# Altium project PC110.PrjPcb (part 3 of 5)

## Sheet ASIC.SchDoc
size 594 x 420 mm
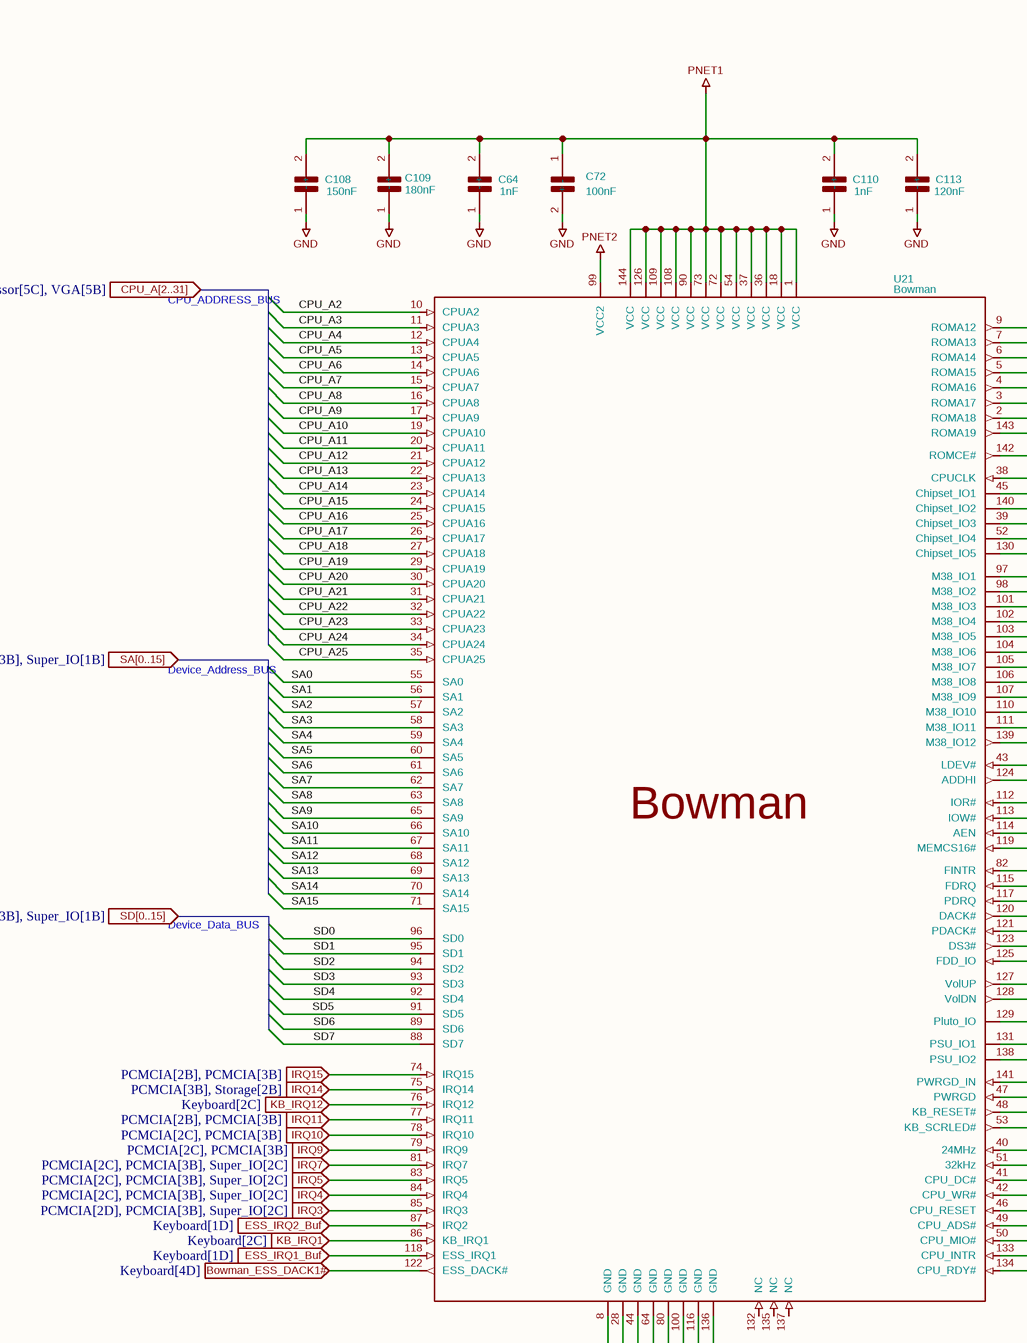
[diagram p20: ASIC.SchDoc, top left]
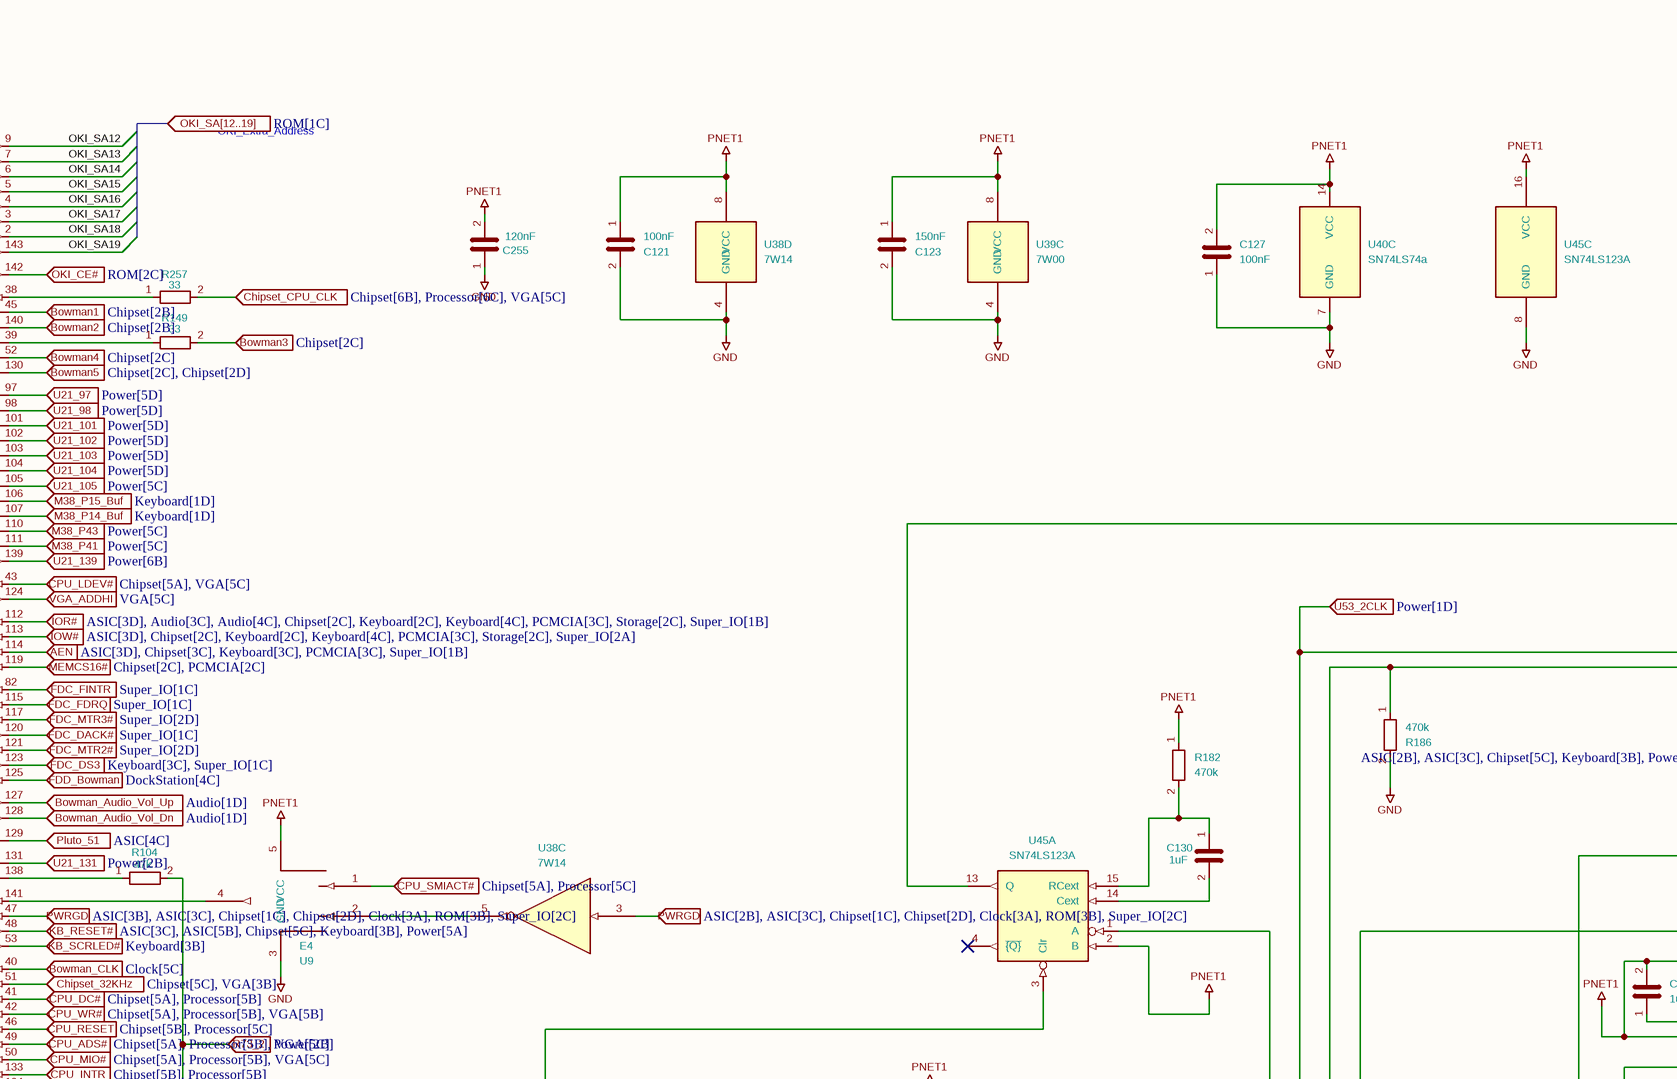
[diagram p21: ASIC.SchDoc, top middle]
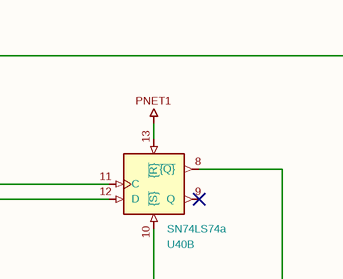
[diagram p22: ASIC.SchDoc, top right]
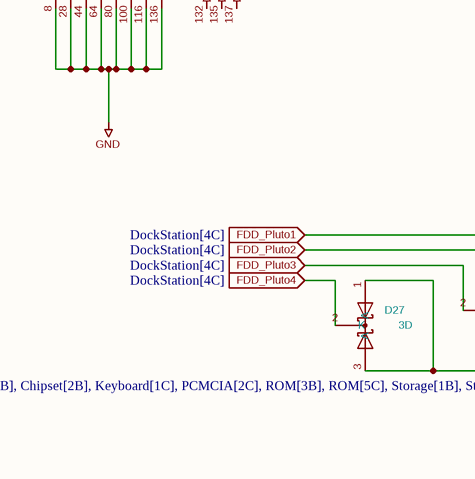
[diagram p23: ASIC.SchDoc, bottom left]
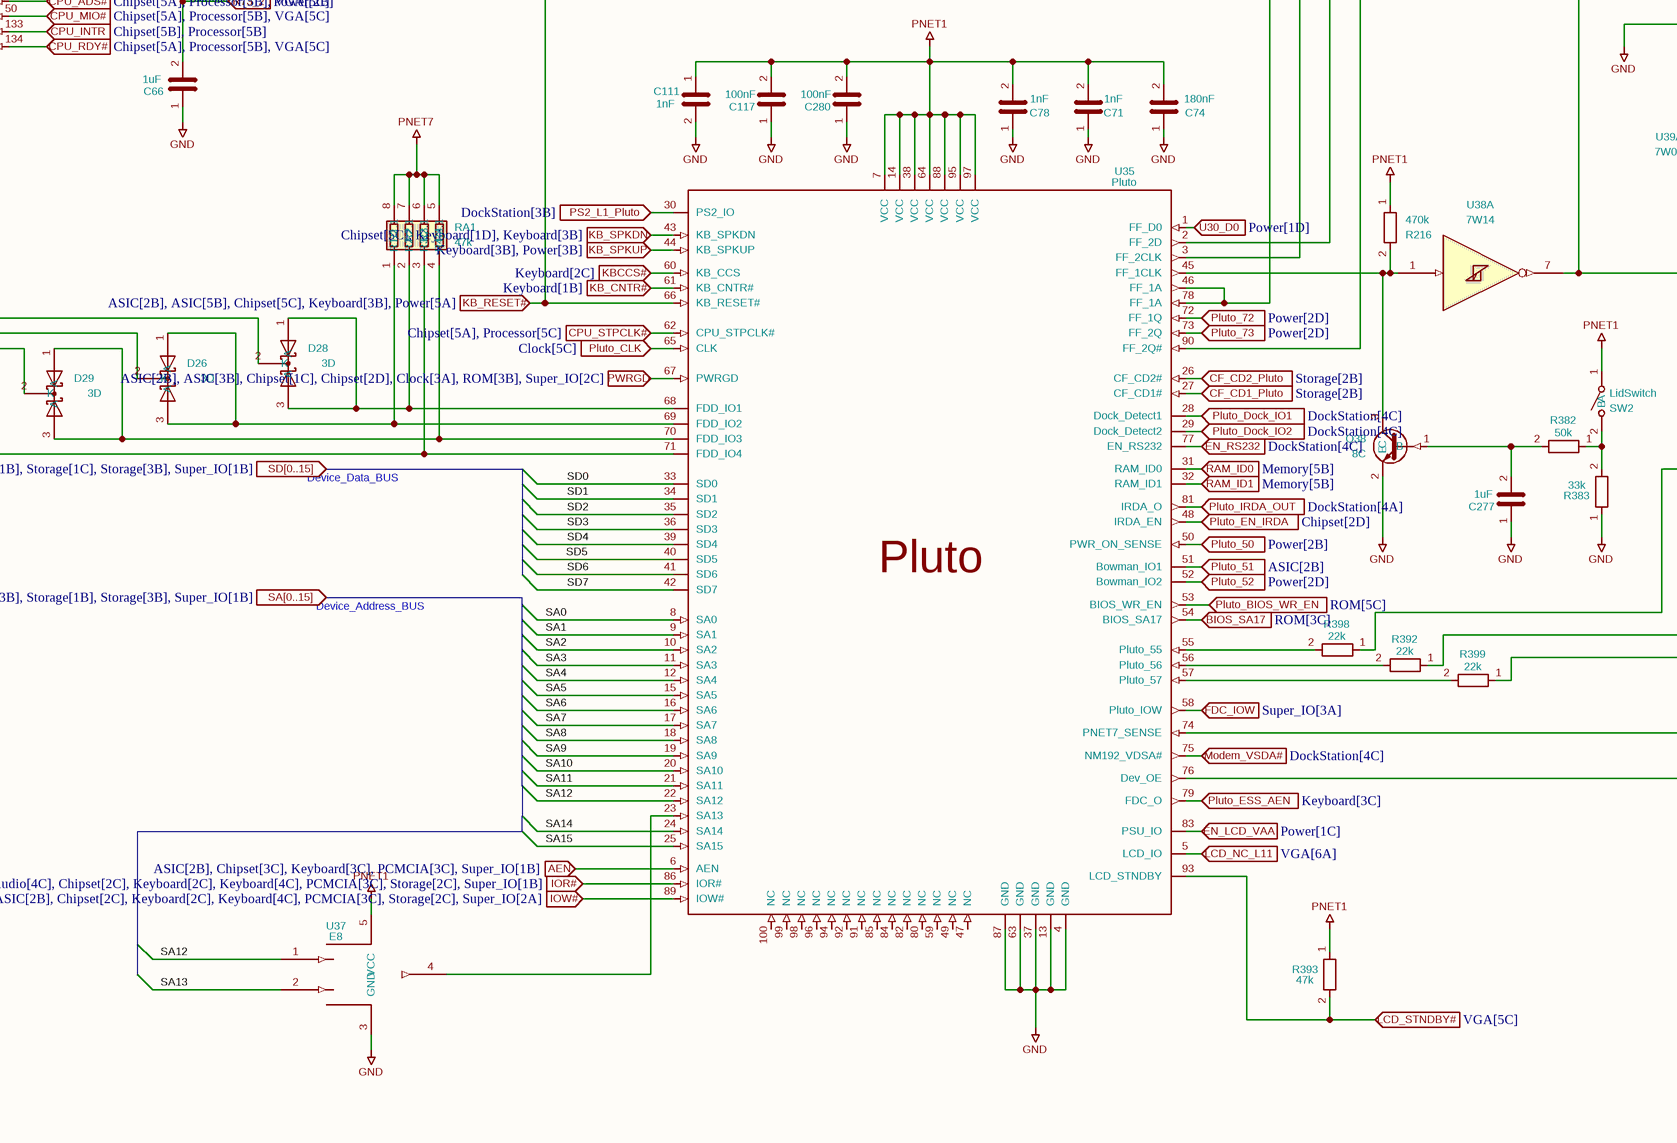
[diagram p24: ASIC.SchDoc, bottom middle]
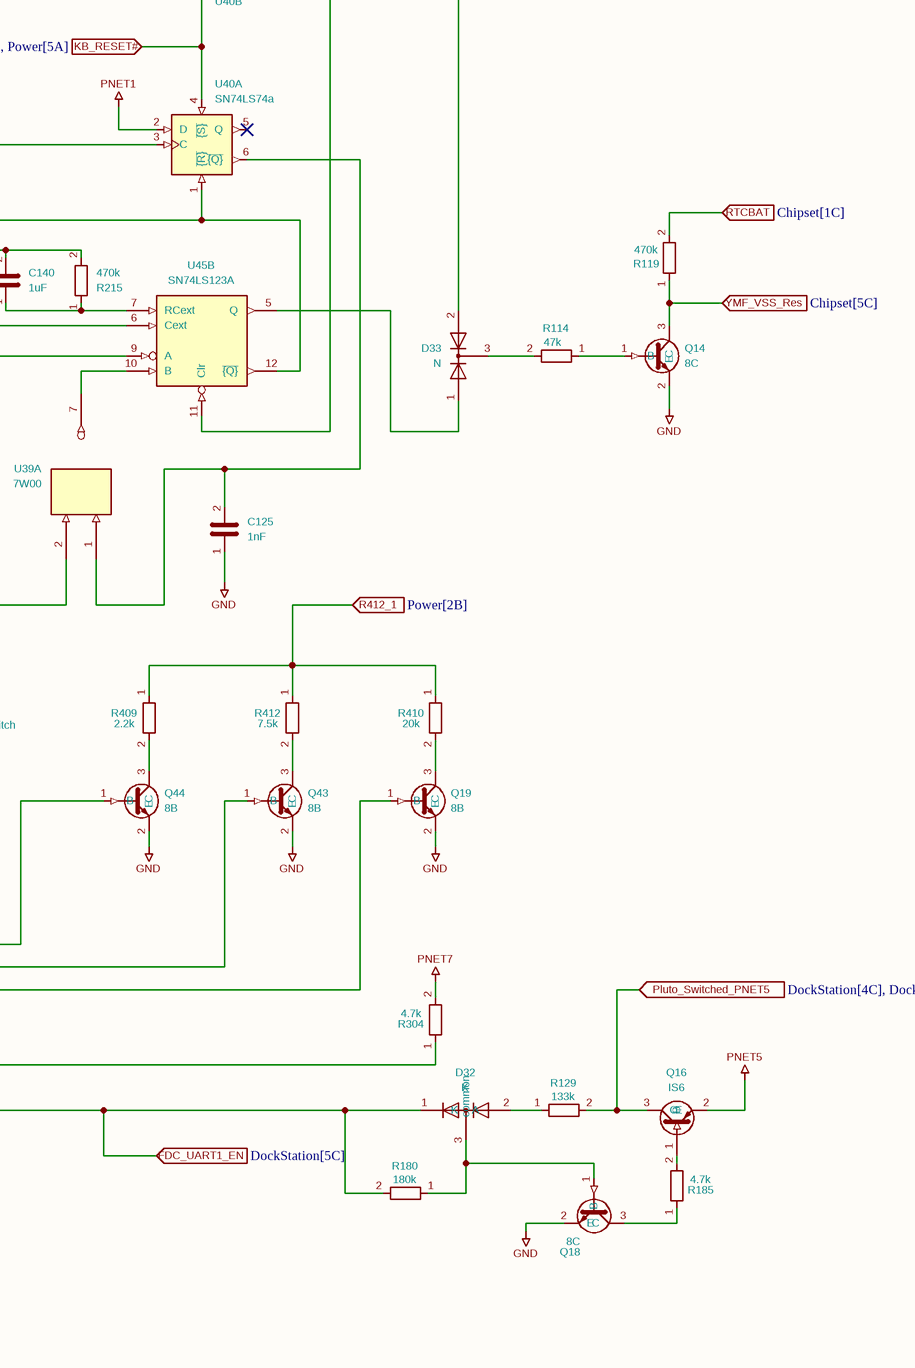
[diagram p25: ASIC.SchDoc, bottom right]

### Parts
C64  1nF  [C_0402_1005Metric]
C66  1uF  [C_0603_1608Metric]
C71  1nF  [C_0402_1005Metric]
C72  100nF  [C_0402_1005Metric]
C74  180nF  [C_0402_1005Metric]
C78  1nF  [C_0402_1005Metric]
C108  150nF  [C_0402_1005Metric]
C109  180nF  [C_0402_1005Metric]
C110  1nF  [C_0402_1005Metric]
C111  1nF  [C_0402_1005Metric]
C113  120nF  [C_0402_1005Metric]
C117  100nF  [C_0402_1005Metric]
C121  100nF  [C_0402_1005Metric]
C123  150nF  [C_0402_1005Metric]
C125  1nF  [C_0402_1005Metric]
C127  100nF  [C_0402_1005Metric]
C130  1uF  [C_0603_1608Metric]
C140  1uF  [C_0603_1608Metric]
C255  120nF  [C_0402_1005Metric]
C277  1uF  [C_0603_1608Metric]
C280  100nF  [C_0402_1005Metric]
D26  3D  [3D]
D27  3D  [3D]
D28  3D  [3D]
D29  3D  [3D]
D32  K  [SOT-416L]
D33  N  [SOT-416]
Q14  8C  [SOT-416]
Q16  IS6  [TSOT-23]
Q18  8C  [SOT-416]
Q19  8B  [SOT-416]
Q38  8C  [SOT-416]
Q43  8B  [SOT-523]
Q44  8B  [SOT-523]
R104  47k  [R_0402_1005Metric]
R114  47k  [R_0402_1005Metric]
R119  470k  [R_0402_1005Metric]
R129  133k  [R_0402_1005Metric]
R149  33  [R_0402_1005Metric]
R180  180k  [R_0402_1005Metric]
R182  470k  [R_0402_1005Metric]
R185  4.7k  [R_0402_1005Metric]
R186  470k  [R_0402_1005Metric]
R215  470k  [R_0402_1005Metric]
R216  470k  [R_0402_1005Metric]
R257  33  [R_0402_1005Metric]
R304  4.7k  [R_0402_1005Metric]
R382  50k  [R_0402_1005Metric]
R383  33k  [R_0402_1005Metric]
R392  22k  [R_0402_1005Metric]
R393  47k  [R_0402_1005Metric]
R398  22k  [R_0402_1005Metric]
R399  22k  [R_0402_1005Metric]
R409  2.2k  [R_0402_1005Metric]
R410  20k  [R_0402_1005Metric]
R412  7.5k  [R_0402_1005Metric]
RA1  47k  [R-array]
SW2  LidSwitch  [LidSwitch]
U9  E4  [SOT-353]
U21  Bowman  [Bowman]
U35  Pluto  [Pluto]
U37  E8  [SOT-353]
U38  7W14  [sso-8]  (parts A,C,D of 4)
U39  7W00  [sso-8]  (parts A,C of 3)
U40  SN74LS74a  [TSSOP-14_4.4x5mm_P0.65mm]  (parts A,B,C of 3)
U45  SN74LS123A  [TSSOP-16_4.4x5mm_P0.65mm]  (parts A,B,C of 3)

### Ports
AEN (in, see ASIC[2B], Chipset[3C], Keyboard[3C], PCMCIA[3C], Super_IO[1B]), AEN (in, see ASIC[3D], Chipset[3C], Keyboard[3C], PCMCIA[3C], Super_IO[1B]), BIOS_SA17 (in, see ROM[3C]), Bowman1 (in, see Chipset[2B]), Bowman2 (in, see Chipset[2B]), Bowman3 (in, see Chipset[2C]), Bowman4 (in, see Chipset[2C]), Bowman5 (in, see Chipset[2C], Chipset[2D]), Bowman_Audio_Vol_Dn (in, see Audio[1D]), Bowman_Audio_Vol_Up (in, see Audio[1D]), Bowman_CLK (in, see Clock[5C]), Bowman_ESS_DACK1# (in, see Keyboard[4D]), CF_CD1_Pluto (in, see Storage[2B]), CF_CD2_Pluto (in, see Storage[2B]), Chipset_32KHz (in, see Chipset[5C], VGA[3B]), Chipset_CPU_CLK (in, see Chipset[6B], Processor[6C], VGA[5C]), CPU_A[2..31] (in, see Chipset[6B], Processor[1B], Processor[5C], VGA[5B]), CPU_ADS# (in, see Chipset[5A], Processor[5B], VGA[5C]), CPU_DC# (in, see Chipset[5A], Processor[5B]), CPU_INTR (in, see Chipset[5B], Processor[5B]), CPU_LDEV# (in, see Chipset[5A], VGA[5C]), CPU_MIO# (in, see Chipset[5A], Processor[5B], VGA[5C]), CPU_RDY# (in, see Chipset[5A], Processor[5B], VGA[5C]), CPU_RESET (in, see Chipset[5B], Processor[5C]), CPU_SMIACT# (in, see Chipset[5A], Processor[5C]), CPU_STPCLK# (in, see Chipset[5A], Processor[5C]), CPU_WR# (in, see Chipset[5A], Processor[5B], VGA[5B]), EN_LCD_VAA (in, see Power[1C]), EN_RS232 (in, see DockStation[4C]), ESS_IRQ1_Buf (in, see Keyboard[1D]), ESS_IRQ2_Buf (in, see Keyboard[1D]), FDC_DACK# (in, see Super_IO[1C]), FDC_DS3 (in, see Keyboard[3C], Super_IO[1C]), FDC_FDRQ (in, see Super_IO[1C]), FDC_FINTR (in, see Super_IO[1C]), FDC_IOW (in, see Super_IO[3A]), FDC_MTR2# (in, see Super_IO[2D]), FDC_MTR3# (in, see Super_IO[2D]), FDC_UART1_EN (in, see DockStation[5C]), FDD_Bowman (in, see DockStation[4C]), FDD_Pluto1 (in, see DockStation[4C]), FDD_Pluto2 (in, see DockStation[4C]), FDD_Pluto3 (in, see DockStation[4C]), FDD_Pluto4 (in, see DockStation[4C]), IOR# (in, see ASIC[2B], Audio[3C], Audio[4C], Chipset[2C], Keyboard[2C], Keyboard[4C], PCMCIA[3C], Storage[2C], Super_IO[1B]), IOR# (in, see ASIC[3D], Audio[3C], Audio[4C], Chipset[2C], Keyboard[2C], Keyboard[4C], PCMCIA[3C], Storage[2C], Super_IO[1B]), IOW# (in, see ASIC[2B], Chipset[2C], Keyboard[2C], Keyboard[4C], PCMCIA[3C], Storage[2C], Super_IO[2A]), IOW# (in, see ASIC[3D], Chipset[2C], Keyboard[2C], Keyboard[4C], PCMCIA[3C], Storage[2C], Super_IO[2A]), IRQ3 (in, see PCMCIA[2D], PCMCIA[3B], Super_IO[2C]), IRQ4 (in, see PCMCIA[2C], PCMCIA[3B], Super_IO[2C]), IRQ5 (in, see PCMCIA[2C], PCMCIA[3B], Super_IO[2C]), IRQ7 (in, see PCMCIA[2C], PCMCIA[3B], Super_IO[2C]), IRQ9 (in, see PCMCIA[2C], PCMCIA[3B]), IRQ10 (in, see PCMCIA[2C], PCMCIA[3B]), IRQ11 (in, see PCMCIA[2B], PCMCIA[3B]), IRQ14 (in, see PCMCIA[3B], Storage[2B]), IRQ15 (in, see PCMCIA[2B], PCMCIA[3B]), KB_CNTR# (in, see Keyboard[1B]), KB_IRQ1 (in, see Keyboard[2C]), KB_IRQ12 (in, see Keyboard[2C]), KB_RESET# (in, see ASIC[2B], ASIC[3C], Chipset[5C], Keyboard[3B], Power[5A]), KB_RESET# (in, see ASIC[2B], ASIC[5B], Chipset[5C], Keyboard[3B], Power[5A]), KB_RESET# (in, see ASIC[3C], ASIC[5B], Chipset[5C], Keyboard[3B], Power[5A]), KB_SCRLED# (in, see Keyboard[3B]), KB_SPKDN (in, see Chipset[5C], Keyboard[1D], Keyboard[3B]), KB_SPKUP (in, see Keyboard[3B], Power[3B]), KBCCS# (in, see Keyboard[2C]), LCD_NC_L11 (in, see VGA[6A]), LCD_STNDBY# (in, see VGA[5C]), M38_P14_Buf (in, see Keyboard[1D]), M38_P15_Buf (in, see Keyboard[1D]), M38_P41 (in, see Power[5C]), M38_P43 (in, see Power[5C]), MEMCS16# (in, see Chipset[2C], PCMCIA[2C]), Modem_VSDA# (in, see DockStation[4C]), OKI_CE# (in, see ROM[2C]), OKI_SA[12..19] (in, see ROM[1C]), Pluto_50 (in, see Power[2B]), Pluto_51 (in, see ASIC[2B]), Pluto_51 (in, see ASIC[4C]), Pluto_52 (in, see Power[2D]), Pluto_72 (in, see Power[2D]), Pluto_73 (in, see Power[2D]), Pluto_BIOS_WR_EN (in, see ROM[5C]), Pluto_CLK (in, see Clock[5C]), Pluto_Dock_IO1 (in, see DockStation[4C]), Pluto_Dock_IO2 (in, see DockStation[4C]), Pluto_EN_IRDA (in, see Chipset[2D]), Pluto_ESS_AEN (in, see Keyboard[3C]), Pluto_IRDA_OUT (in, see DockStation[4A]), Pluto_Switched_PNET5 (in, see DockStation[4C], DockStation[5C]), PS2_L1_Pluto (in, see DockStation[3B]), PWRGD (in, see ASIC[2B], ASIC[3B], Chipset[1C], Chipset[2D], Clock[3A], ROM[3B], Super_IO[2C]), PWRGD (in, see ASIC[2B], ASIC[3C], Chipset[1C], Chipset[2D], Clock[3A], ROM[3B], Super_IO[2C]), PWRGD (in, see ASIC[3B], ASIC[3C], Chipset[1C], Chipset[2D], Clock[3A], ROM[3B], Super_IO[2C]), R73_2 (in, see Power[2B]), R412_1 (in, see Power[2B]), RAM_ID0 (in, see Memory[5B]), RAM_ID1 (in, see Memory[5B]), RTCBAT (in, see Chipset[1C]), SA[0..15] (in, see ASIC[1B], Audio[4B], Chipset[2D], Chipset[6B], Keyboard[1C], PCMCIA[2B], ROM[1B], ROM[3B], Storage[1B], Storage[3B], Super_IO[1B]), SA[0..15] (in, see ASIC[3D], Audio[4B], Chipset[2D], Chipset[6B], Keyboard[1C], PCMCIA[2B], ROM[1B], ROM[3B], Storage[1B], Storage[3B], Super_IO[1B]), SD[0..15] (in, see ASIC[1B], Audio[3B], Chipset[2B], Keyboard[1C], PCMCIA[2C], ROM[3B], ROM[5C], Storage[1B], Storage[1C], Storage[3B], Super_IO[1B]), SD[0..15] (in, see ASIC[3C], Audio[3B], Chipset[2B], Keyboard[1C], PCMCIA[2C], ROM[3B], ROM[5C], Storage[1B], Storage[1C], Storage[3B], Super_IO[1B]), U21_97 (in, see Power[5D]), U21_98 (in, see Power[5D]), U21_101 (in, see Power[5D]), U21_102 (in, see Power[5D]), U21_103 (in, see Power[5D]), U21_104 (in, see Power[5D]), U21_105 (in, see Power[5C]), U21_131 (in, see Power[2B]), U21_139 (in, see Power[6B]), U30_D0 (in, see Power[1D]), U53_2CLK (in, see Power[1D]), VGA_ADDHI (in, see VGA[5C]), YMF_VSS_Res (in, see Chipset[5C])

### Nets
GND: C64.1(+) C66.1 C71.1 C72.2(-) C74.1 C78.1 C108.1(+) C109.1(+) C110.1(+) C111.2 C113.1(+) C117.1 C121.2 C123.2 C125.1 C127.1 C255.1 C277.1 C280.1 Q14.2(E) Q18.2(E) Q19.2(E) Q38.2(E) Q43.2(E) Q44.2(E) R186.2 R383.1 U9.3(GND) U21.8(GND) U21.28(GND) U21.44(GND) U21.64(GND) U21.80(GND) U21.100(GND) U21.116(GND) U21.136(GND) U35.4(GND) U35.13(GND) U35.37(GND) U35.63(GND) U35.87(GND) U37.3(GND) U38.4(GND) U39.4(GND) U40.7(GND) U45.8(GND) U45.9(A)
PNET1: C64.2(-) C71.2 C72.1(+) C74.2 C78.2 C108.2(-) C109.2(-) C110.2(-) C111.1 C113.2(-) C117.2 C121.1 C123.1 C127.2 C140.2 C255.2 C280.2 R182.1 R215.2 R216.1 R393.1 SW2.1(A) U9.5(VCC) U21.1(VCC) U21.18(VCC) U21.36(VCC) U21.37(VCC) U21.54(VCC) U21.72(VCC) U21.73(VCC) U21.90(VCC) U21.108(VCC) U21.109(VCC) U21.126(VCC) U21.144(VCC) U35.7(VCC) U35.14(VCC) U35.38(VCC) U35.64(VCC) U35.88(VCC) U35.95(VCC) U35.97(VCC) U37.5(VCC) U38.8(VCC) U39.8(VCC) U40.2(D) U40.13(~{{R}}) U40.14(VCC) U45.2(B) U45.6(Cext) U45.16(VCC)
PNET2: U21.99(VCC2)
PNET5: Q16.2(E)
PNET7: R304.2 RA1.5(R4.2) RA1.6(R3.2) RA1.7(R2.2) RA1.8(R1.2)
AEN: U21.114(AEN) U35.6(AEN) ; port AEN
BIOS_SA17: U35.54(BIOS_SA17) ; port BIOS_SA17
Bowman1: U21.45(Chipset_IO1) ; port Bowman1
Bowman2: U21.140(Chipset_IO2) ; port Bowman2
Bowman3: R149.2 ; port Bowman3
Bowman4: U21.52(Chipset_IO4) ; port Bowman4
Bowman5: U21.130(Chipset_IO5) ; port Bowman5
Bowman_Audio_Vol_Dn: U21.128(VolDN) ; port Bowman_Audio_Vol_Dn
Bowman_Audio_Vol_Up: U21.127(VolUP) ; port Bowman_Audio_Vol_Up
Bowman_CLK: U21.40(24MHz) ; port Bowman_CLK
Bowman_ESS_DACK1#: U21.122(ESS_DACK#) ; port Bowman_ESS_DACK1#
CF_CD1_Pluto: U35.27(CF_CD1#) ; port CF_CD1_Pluto
CF_CD2_Pluto: U35.26(CF_CD2#) ; port CF_CD2_Pluto
Chipset_32KHz: U21.51(32kHz) ; port Chipset_32KHz
Chipset_CPU_CLK: R257.2 ; port Chipset_CPU_CLK
CPU_A2: U21.10(CPUA2)
CPU_A3: U21.11(CPUA3)
CPU_A4: U21.12(CPUA4)
CPU_A5: U21.13(CPUA5)
CPU_A6: U21.14(CPUA6)
CPU_A7: U21.15(CPUA7)
CPU_A8: U21.16(CPUA8)
CPU_A9: U21.17(CPUA9)
CPU_A10: U21.19(CPUA10)
CPU_A11: U21.20(CPUA11)
CPU_A12: U21.21(CPUA12)
CPU_A13: U21.22(CPUA13)
CPU_A14: U21.23(CPUA14)
CPU_A15: U21.24(CPUA15)
CPU_A16: U21.25(CPUA16)
CPU_A17: U21.26(CPUA17)
CPU_A18: U21.27(CPUA18)
CPU_A19: U21.29(CPUA19)
CPU_A20: U21.30(CPUA20)
CPU_A21: U21.31(CPUA21)
CPU_A22: U21.32(CPUA22)
CPU_A23: U21.33(CPUA23)
CPU_A24: U21.34(CPUA24)
CPU_A25: U21.35(CPUA25)
CPU_ADS#: U21.49(CPU_ADS#) ; port CPU_ADS#
CPU_DC#: U21.41(CPU_DC#) ; port CPU_DC#
CPU_INTR: U21.133(CPU_INTR) ; port CPU_INTR
CPU_LDEV#: U21.43(LDEV#) ; port CPU_LDEV#
CPU_MIO#: U21.50(CPU_MIO#) ; port CPU_MIO#
CPU_RDY#: U21.134(CPU_RDY#) ; port CPU_RDY#
CPU_RESET: U21.46(CPU_RESET) ; port CPU_RESET
CPU_SMIACT#: U9.1 ; port CPU_SMIACT#
CPU_STPCLK#: U35.62(CPU_STPCLK#) ; port CPU_STPCLK#
CPU_WR#: U21.42(CPU_WR#) ; port CPU_WR#
EN_LCD_VAA: U35.83(PSU_IO) ; port EN_LCD_VAA
EN_RS232: U35.77(EN_RS232) ; port EN_RS232
ESS_IRQ1_Buf: U21.118(ESS_IRQ1) ; port ESS_IRQ1_Buf
ESS_IRQ2_Buf: U21.87(IRQ2) ; port ESS_IRQ2_Buf
FDC_DACK#: U21.120(DACK#) ; port FDC_DACK#
FDC_DS3: U21.123(DS3#) ; port FDC_DS3
FDC_FDRQ: U21.115(FDRQ) ; port FDC_FDRQ
FDC_FINTR: U21.82(FINTR) ; port FDC_FINTR
FDC_IOW: U35.58(Pluto_IOW) ; port FDC_IOW
FDC_MTR2#: U21.121(PDACK#) ; port FDC_MTR2#
FDC_MTR3#: U21.117(PDRQ) ; port FDC_MTR3#
FDC_UART1_EN: D32.1(K) R180.2 U35.76(Dev_OE) ; port FDC_UART1_EN
FDD_Bowman: U21.125(FDD_IO) ; port FDD_Bowman
FDD_Pluto1: D28.2(K) ; port FDD_Pluto1
FDD_Pluto2: D26.2(K) ; port FDD_Pluto2
FDD_Pluto3: D29.2(K) ; port FDD_Pluto3
FDD_Pluto4: D27.2(K) ; port FDD_Pluto4
IOR#: U21.112(IOR#) U35.86(IOR#) ; port IOR#
IOW#: U21.113(IOW#) U35.89(IOW#) ; port IOW#
IRQ3: U21.85(IRQ3) ; port IRQ3
IRQ4: U21.84(IRQ4) ; port IRQ4
IRQ5: U21.83(IRQ5) ; port IRQ5
IRQ7: U21.81(IRQ7) ; port IRQ7
IRQ9: U21.79(IRQ9) ; port IRQ9
IRQ10: U21.78(IRQ10) ; port IRQ10
IRQ11: U21.77(IRQ11) ; port IRQ11
IRQ14: U21.75(IRQ14) ; port IRQ14
IRQ15: U21.74(IRQ15) ; port IRQ15
KB_CNTR#: U35.61(KB_CNTR#) ; port KB_CNTR#
KB_IRQ1: U21.86(KB_IRQ1) ; port KB_IRQ1
KB_IRQ12: U21.76(IRQ12) ; port KB_IRQ12
KB_RESET#: U21.48(KB_RESET#) U35.66(KB_RESET#) U40.4(~{{S}}) U40.10(~{{S}}) U45.3(Clr) ; port KB_RESET#
KB_SCRLED#: U21.53(KB_SCRLED#) ; port KB_SCRLED#
KB_SPKDN: U35.43(KB_SPKDN) ; port KB_SPKDN
KB_SPKUP: U35.44(KB_SPKUP) ; port KB_SPKUP
KBCCS#: U35.60(KB_CCS) ; port KBCCS#
LCD_NC_L11: U35.5(LCD_IO) ; port LCD_NC_L11
LCD_STNDBY#: R393.2 U35.93(LCD_STNDBY) ; port LCD_STNDBY#
M38_P14_Buf: U21.107(M38_IO9) ; port M38_P14_Buf
M38_P15_Buf: U21.106(M38_IO8) ; port M38_P15_Buf
M38_P41: U21.111(M38_IO11) ; port M38_P41
M38_P43: U21.110(M38_IO10) ; port M38_P43
MEMCS16#: U21.119(MEMCS16#) ; port MEMCS16#
Modem_VSDA#: U35.75(NM192_VDSA#) ; port Modem_VSDA#
OKI_CE#: U21.142(ROMCE#) ; port OKI_CE#
OKI_SA12: U21.9(ROMA12)
OKI_SA13: U21.7(ROMA13)
OKI_SA14: U21.6(ROMA14)
OKI_SA15: U21.5(ROMA15)
OKI_SA16: U21.4(ROMA16)
OKI_SA17: U21.3(ROMA17)
OKI_SA18: U21.2(ROMA18)
OKI_SA19: U21.143(ROMA19)
Pluto_50: U35.50(PWR_ON_SENSE) ; port Pluto_50
Pluto_51: U21.129(Pluto_IO) U35.51(Bowman_IO1) ; port Pluto_51
Pluto_52: U35.52(Bowman_IO2) ; port Pluto_52
Pluto_72: U35.72(FF_1Q) ; port Pluto_72
Pluto_73: U35.73(FF_2Q) ; port Pluto_73
Pluto_BIOS_WR_EN: U35.53(BIOS_WR_EN) ; port Pluto_BIOS_WR_EN
Pluto_CLK: U35.65(CLK) ; port Pluto_CLK
Pluto_Dock_IO1: U35.28(Dock_Detect1) ; port Pluto_Dock_IO1
Pluto_Dock_IO2: U35.29(Dock_Detect2) ; port Pluto_Dock_IO2
Pluto_EN_IRDA: U35.48(IRDA_EN) ; port Pluto_EN_IRDA
Pluto_ESS_AEN: U35.79(FDC_O) ; port Pluto_ESS_AEN
Pluto_IRDA_OUT: U35.81(IRDA_O) ; port Pluto_IRDA_OUT
Pluto_Switched_PNET5: Q16.3(C) R129.2 ; port Pluto_Switched_PNET5
PS2_L1_Pluto: U35.30(PS2_IO) ; port PS2_L1_Pluto
PWRGD: U21.47(PWRGD) U35.67(PWRGD) U38.3 ; port PWRGD
R73_2: C66.2 R104.2 ; port R73_2
R412_1: R409.1 R410.1 R412.1 ; port R412_1
RAM_ID0: U35.31(RAM_ID0) ; port RAM_ID0
RAM_ID1: U35.32(RAM_ID1) ; port RAM_ID1
RTCBAT: R119.2 ; port RTCBAT
SA0: U21.55(SA0) U35.8(SA0)
SA1: U21.56(SA1) U35.9(SA1)
SA2: U21.57(SA2) U35.10(SA2)
SA3: U21.58(SA3) U35.11(SA3)
SA4: U21.59(SA4) U35.12(SA4)
SA5: U21.60(SA5) U35.15(SA5)
SA6: U21.61(SA6) U35.16(SA6)
SA7: U21.62(SA7) U35.17(SA7)
SA8: U21.63(SA8) U35.18(SA8)
SA9: U21.65(SA9) U35.19(SA9)
SA10: U21.66(SA10) U35.20(SA10)
SA11: U21.67(SA11) U35.21(SA11)
SA12: U21.68(SA12) U35.22(SA12) U37.1
SA13: U21.69(SA13) U37.2
SA14: U21.70(SA14) U35.24(SA14)
SA15: U21.71(SA15) U35.25(SA15)
SD0: U21.96(SD0) U35.33(SD0)
SD1: U21.95(SD1) U35.34(SD1)
SD2: U21.94(SD2) U35.35(SD2)
SD3: U21.93(SD3) U35.36(SD3)
SD4: U21.92(SD4) U35.39(SD4)
SD5: U21.91(SD5) U35.40(SD5)
SD6: U21.89(SD6) U35.41(SD6)
SD7: U21.88(SD7) U35.42(SD7)
U21_97: U21.97(M38_IO1) ; port U21_97
U21_98: U21.98(M38_IO2) ; port U21_98
U21_101: U21.101(M38_IO3) ; port U21_101
U21_102: U21.102(M38_IO4) ; port U21_102
U21_103: U21.103(M38_IO5) ; port U21_103
U21_104: U21.104(M38_IO6) ; port U21_104
U21_105: U21.105(M38_IO7) ; port U21_105
U21_131: U21.131(PSU_IO1) ; port U21_131
U21_139: U21.139(M38_IO12) ; port U21_139
U30_D0: U35.1(FF_D0) ; port U30_D0
U53_2CLK: U35.3(FF_2CLK) U40.11(C) ; port U53_2CLK
VGA_ADDHI: U21.124(ADDHI) ; port VGA_ADDHI
YMF_VSS_Res: Q14.3(C) R119.1 ; port YMF_VSS_Res
NetC125_2: C125.2 U39.1 U40.6(~{{Q}})
NetC130_1: C130.1 R182.2 U45.15(RCext)
NetC130_2: C130.2 U45.14(Cext)
NetC140_1: C140.1 R215.1 U45.7(RCext)
NetC277_2: C277.2 Q38.1(B) R382.2
NetD26_1: D26.1(A) D26.3(A) RA1.1(R1.1) U35.69(FDD_IO2)
NetD27_1: D27.1(A) D27.3(A) RA1.3(R3.1) U35.71(FDD_IO4)
NetD28_1: D28.1(A) D28.3(A) RA1.2(R2.1) U35.68(FDD_IO1)
NetD29_1: D29.1(A) D29.3(A) RA1.4(R4.1) U35.70(FDD_IO3)
NetD32_2: D32.2(A) R129.1
NetD32_3: D32.3(common) Q18.1(B) R180.1
NetD33_1: D33.1 U45.5(Q)
NetD33_2: D33.2 U45.13(Q)
NetD33_3: D33.3 R114.2
NetQ14_1: Q14.1(B) R114.1
NetQ16_1: Q16.1(B) R185.2
NetQ18_3: Q18.3(C) R185.1
NetQ19_1: Q19.1(B) R399.1
NetQ19_3: Q19.3(C) R410.2
NetQ38_3: Q38.3(C) R216.2 U35.45(FF_1CLK) U38.1
NetQ43_1: Q43.1(B) R392.1
NetQ43_3: Q43.3(C) R412.2
NetQ44_1: Q44.1(B) R398.1
NetQ44_3: Q44.3(C) R409.2
NetR104_1: R104.1 U21.138(PSU_IO2)
NetR149_1: R149.1 U21.39(Chipset_IO3)
NetR186_1: R186.1 U35.2(FF_2D) U40.12(D)
NetR257_1: R257.1 U21.38(CPUCLK)
NetR304_1: R304.1 U35.74(PNET7_SENSE)
NetR382_1: R382.1 R383.2 SW2.2(B)
NetR392_2: R392.2 U35.56(Pluto_56)
NetR398_2: R398.2 U35.55(Pluto_55)
NetR399_2: R399.2 U35.57(Pluto_57)
NetU9_2: U9.2 U38.5
NetU9_4: U9.4 U21.141(PWRGD_IN)
NetU35_23: U35.23(SA13) U37.4
NetU35_46: U35.46(FF_1A) U35.78(FF_1A) U45.1(A)
NetU35_90: U35.90(FF_2Q#) U40.1(~{{R}}) U45.12(~{{Q}})
NetU38_7: U38.7 U39.2 U40.3(C)
NetU39_7: U39.7 U45.10(B)
NetU40_8: U40.8(~{{Q}}) U45.11(Clr)

Not connected (* = marked no-connect by the designer): U21 132(NC) 135(NC) 137(NC); U35 47(NC) 49(NC) 59(NC) 80(NC) 82(NC) 84(NC) 85(NC) 91(NC) 92(NC) 94(NC) 96(NC) 98(NC) 99(NC) 100(NC); U40 5(Q)* 9(Q)*; U45 4(~{{Q}})*

### Notes on the sheet
- CPU_ADDRESS_BUS
- OKI_Extra_Address
- Device_Address_BUS
- Device_Data_BUS
- 1
- 2
- 3
- 4
- 5
- 6
- 7
- 8
- 9
- 10
- 11
- A
- B
- C
- D
- E
- F
- G
- H
- Title: PC110
- File: ASIC.kicad_sch
- Sheet: /
- Recreated by: Ahmad Byagowi
- KiCad E.D.A.  kicad (5.1.4)-1
- Size: A2
- Date:
- Rev:
- Id: 1/1

### Library data of the parts
C64 C66 C71 C72 C74 C78 C108-C111 C113 C117 C121 C123 C125 C127 C130 C140 C255 C277 C280 = C
  C64 C71 C78 C110 C111 C125: Value: 1nF; Footprint: Capacitor_SMD:C_0402_1005Metric
  C66 C130 C140 C277: Value: 1uF; Footprint: Capacitor_SMD:C_0603_1608Metric
  C72 C117 C121 C127 C280: Value: 100nF; Footprint: Capacitor_SMD:C_0402_1005Metric
  C74 C109: Value: 180nF; Footprint: Capacitor_SMD:C_0402_1005Metric
  C108 C123: Value: 150nF; Footprint: Capacitor_SMD:C_0402_1005Metric
  C113 C255: Value: 120nF; Footprint: Capacitor_SMD:C_0402_1005Metric
D26-D29 = D_Schottky_Dual_CommonCathode_AKA: Value: 3D; Footprint: PC110:3D
D32 = D_Dual_Series_KAC: Value: K; Footprint: PC110:SOT-416L
D33 = 3D_Diode: Value: N; Footprint: Package_TO_SOT_SMD:SOT-416
Q14 Q18 Q19 Q38 Q43 Q44 = MMBTA44
  Q14 Q18 Q38: Value: 8C; Footprint: Package_TO_SOT_SMD:SOT-416
  Q19: Value: 8B; Footprint: Package_TO_SOT_SMD:SOT-416
  Q43 Q44: Value: 8B; Footprint: Package_TO_SOT_SMD:SOT-523
Q16 = Q_PNP_Generic_BEC: Value: IS6; Footprint: PCM_Package_TO_SOT_SMD_AKL:TSOT-23
R104 R114 R119 R129 R149 R180 R182 R185 R186 R215 R216 R257 R304 R382 R383 R392 R393 R398 R399 R409 R410 R412 = R
  R104 R114: Value: 47k; Footprint: PCM_Resistor_SMD_AKL:R_0402_1005Metric
  R119 R182 R186 R215 R216: Value: 470k; Footprint: PCM_Resistor_SMD_AKL:R_0402_1005Metric
  R129: Value: 133k; Footprint: PCM_Resistor_SMD_AKL:R_0402_1005Metric
  R149: Value: 33; Footprint: PCM_Resistor_SMD_AKL:R_0402_1005Metric
  R180: Value: 180k; Footprint: PCM_Resistor_SMD_AKL:R_0402_1005Metric
  R185: Value: 4.7k; Footprint: PCM_Resistor_SMD_AKL:R_0402_1005Metric
  R257: Value: 33; Footprint: Resistor_SMD:R_0402_1005Metric
  R304: Value: 4.7k; Footprint: Resistor_SMD:R_0402_1005Metric
  R382: Value: 50k; Footprint: Resistor_SMD:R_0402_1005Metric
  R383: Value: 33k; Footprint: Resistor_SMD:R_0402_1005Metric
  R392 R398 R399: Value: 22k; Footprint: Resistor_SMD:R_0402_1005Metric
  R393: Value: 47k; Footprint: Resistor_SMD:R_0402_1005Metric
  R409: Value: 2.2k; Footprint: Resistor_SMD:R_0402_1005Metric
  R410: Value: 20k; Footprint: Resistor_SMD:R_0402_1005Metric
  R412: Value: 7.5k; Footprint: Resistor_SMD:R_0402_1005Metric
RA1 = R_Pack04: Value: 47k; Footprint: PC110:R-array
SW2 = SW_SPST: Value: LidSwitch; Footprint: PC110:LidSwitch
U9 = 74AHC1G32: Value: E4; Footprint: PC110:SOT-353
U37 = 74AHC1G86: Value: E8; Footprint: PC110:SOT-353
U38 = 74LVC3G14: Value: 7W14; Footprint: PC110:sso-8
U39 = 74AHC2G00: Value: 7W00; Footprint: PC110:sso-8
U40 = 74HC74: Value: SN74LS74a; Footprint: Package_SO:TSSOP-14_4.4x5mm_P0.65mm
U45 = 74HC123: Value: SN74LS123A; Footprint: Package_SO:TSSOP-16_4.4x5mm_P0.65mm
U21 = Bowman: Value: Bowman; Footprint: PC110:Bowman
U35 = Pluto: Value: Pluto; Footprint: PC110:Pluto

## Sheet Keyboard.SchDoc
size 420 x 297 mm
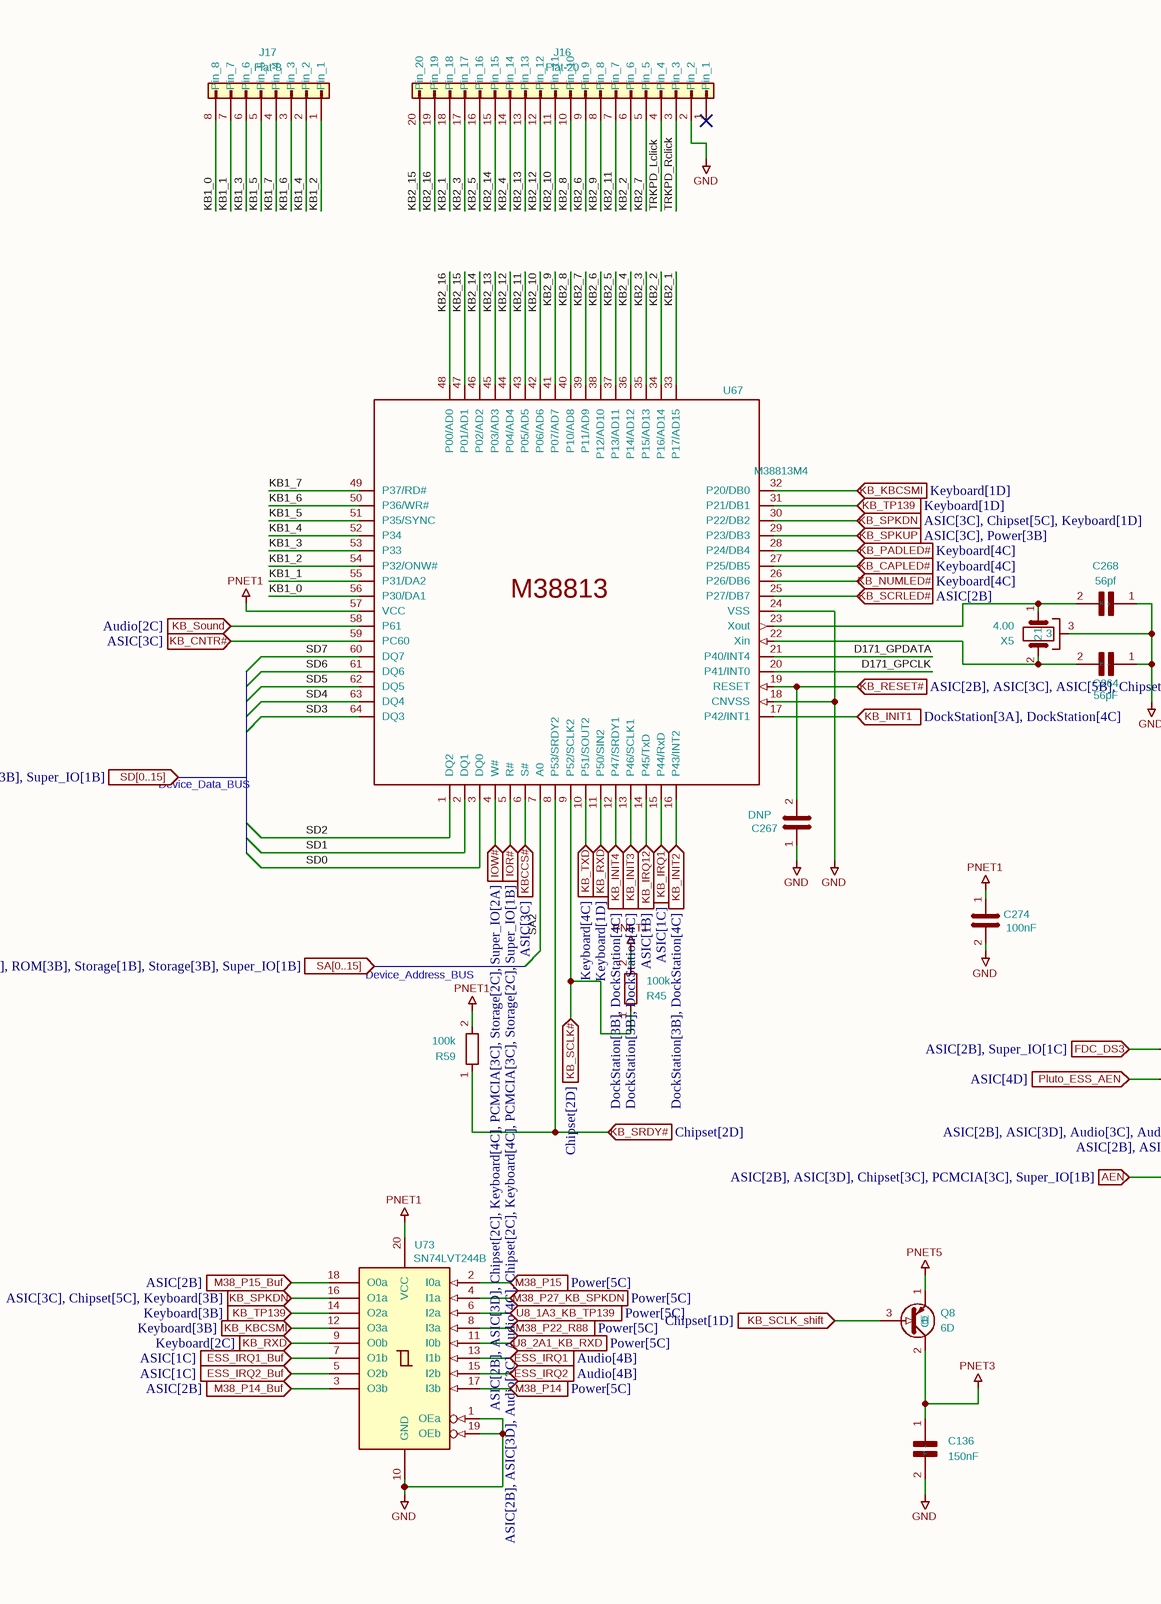
[diagram p26: Keyboard.SchDoc, left]
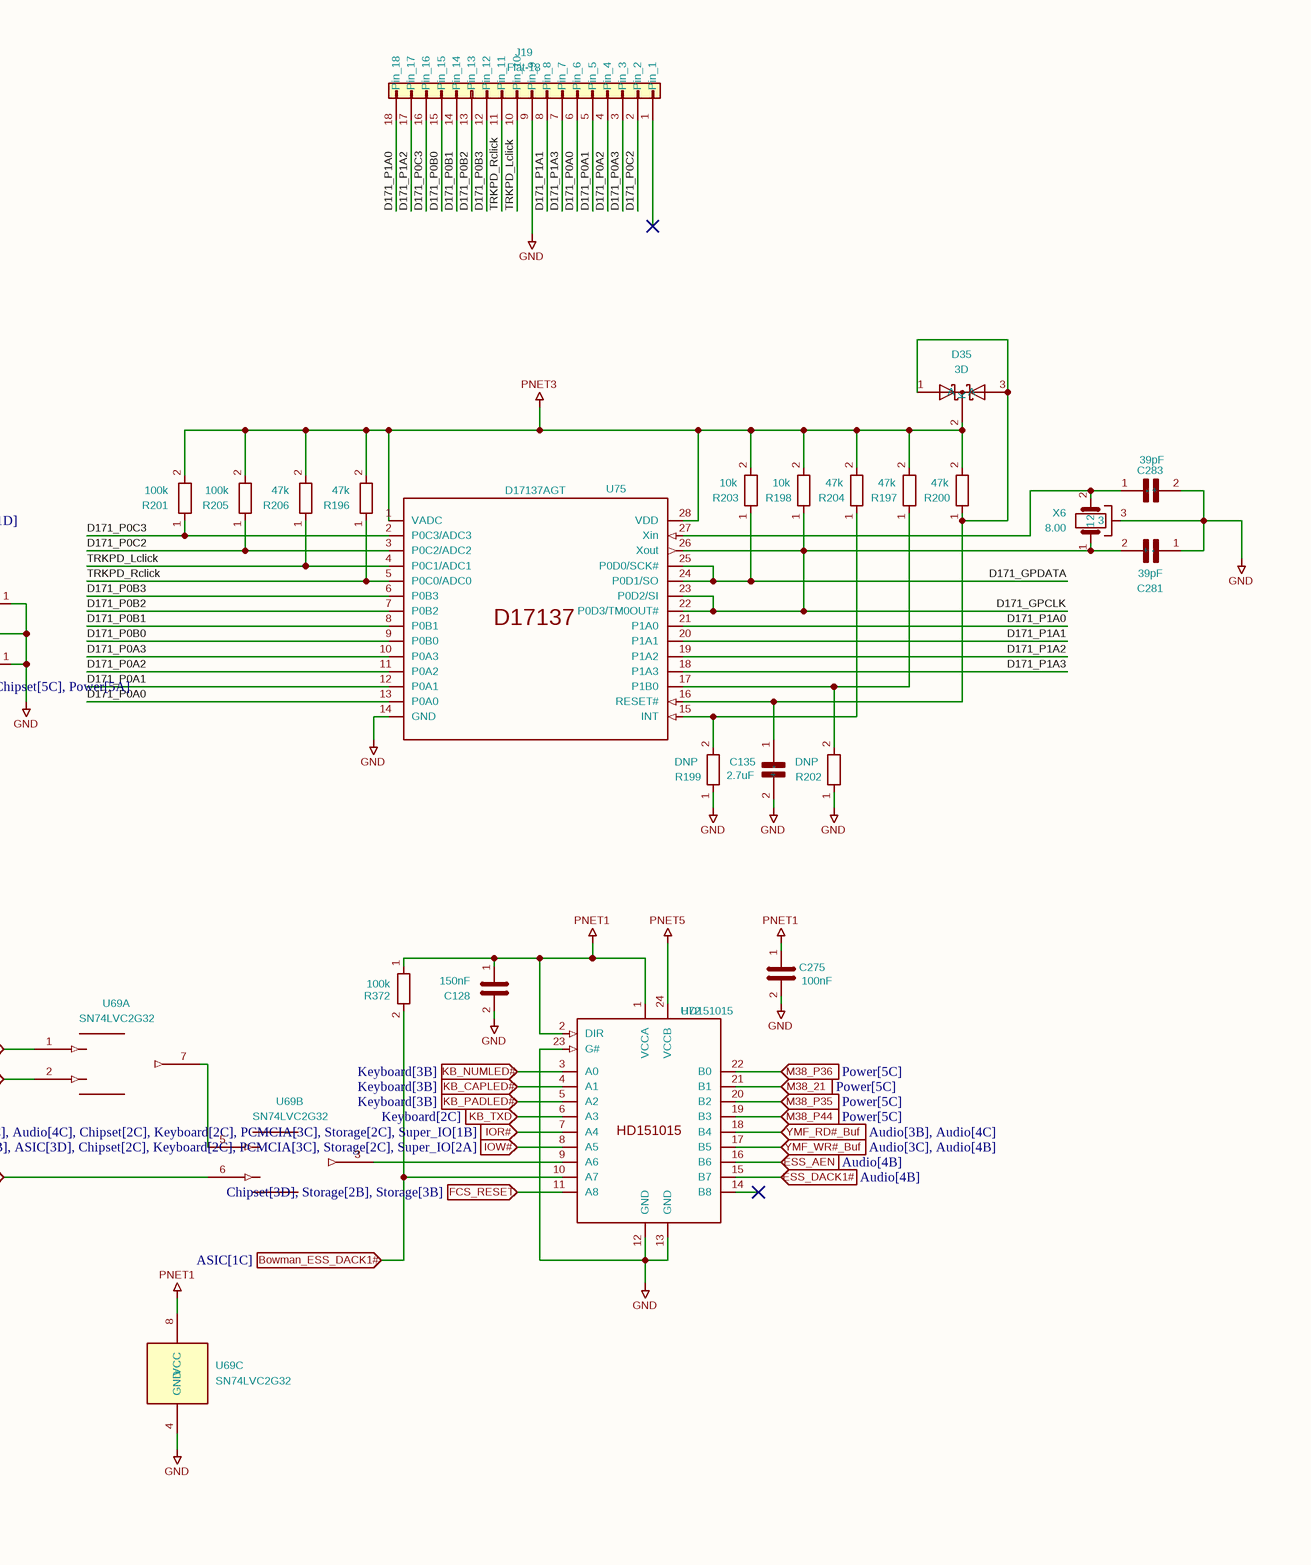
[diagram p27: Keyboard.SchDoc, right]

### Parts
C128  150nF  [C_0402_1005Metric]
C135  2.7uF  [C_0805_2012Metric]
C136  150nF  [C_0402_1005Metric]
C264  56pF  [C_0402_1005Metric]
C267  DNP  [C_0402_1005Metric]
C268  56pf  [C_0402_1005Metric]
C274  100nF  [C_0402_1005Metric]
C275  100nF  [C_0402_1005Metric]
C281  39pF  [C_0402_1005Metric]
C283  39pF  [C_0402_1005Metric]
D35  3D  [3D]
J16  Flat-20  [Flat-20]
J17  Flat-8  [Flat-8]
J19  Flat-18  [Flat-18]
Q8  6D  [3D]
R45  100k  [R_0402_1005Metric]
R59  100k  [R_0402_1005Metric]
R196  47k  [R_0402_1005Metric]
R197  47k  [R_0402_1005Metric]
R198  10k  [R_0402_1005Metric]
R199  DNP  [R_0402_1005Metric]
R200  47k  [R_0402_1005Metric]
R201  100k  [R_0402_1005Metric]
R202  DNP  [R_0402_1005Metric]
R203  10k  [R_0402_1005Metric]
R204  47k  [R_0402_1005Metric]
R205  100k  [R_0402_1005Metric]
R206  47k  [R_0402_1005Metric]
R372  100k  [R_0402_1005Metric]
U67  M38813M4  [QFN64]
U69  SN74LVC2G32  [SSOP-8_2.95x2.8mm_P0.65mm]  (parts A,B,C of 3)
U72  HD151015  [SSOP-24_5.3x8.2mm_P0.65mm]
U73  SN74LVT244B  [TSSOP-20_4.4x6.5mm_P0.65mm]
U75  D17137AGT  [SSOP-28]
X5  4.00  [XTAL-5]
X6  8.00  [XTAL-4]

### Ports
AEN (in, see ASIC[2B], ASIC[3D], Chipset[3C], PCMCIA[3C], Super_IO[1B]), Bowman_ESS_DACK1# (in, see ASIC[1C]), ESS_AEN (in, see Audio[4B]), ESS_DACK1# (in, see Audio[4B]), ESS_IRQ1 (in, see Audio[4B]), ESS_IRQ1_Buf (in, see ASIC[1C]), ESS_IRQ2 (in, see Audio[4B]), ESS_IRQ2_Buf (in, see ASIC[1C]), FCS_RESET (in, see Chipset[3D], Storage[2B], Storage[3B]), FDC_DS3 (in, see ASIC[2B], Super_IO[1C]), IOR# (in, see ASIC[2B], ASIC[3D], Audio[3C], Audio[4C], Chipset[2C], Keyboard[2C], PCMCIA[3C], Storage[2C], Super_IO[1B]), IOR# (in, see ASIC[2B], ASIC[3D], Audio[3C], Audio[4C], Chipset[2C], Keyboard[4C], PCMCIA[3C], Storage[2C], Super_IO[1B]), IOW# (in, see ASIC[2B], ASIC[3D], Chipset[2C], Keyboard[2C], PCMCIA[3C], Storage[2C], Super_IO[2A]), IOW# (in, see ASIC[2B], ASIC[3D], Chipset[2C], Keyboard[4C], PCMCIA[3C], Storage[2C], Super_IO[2A]), KB_CAPLED# (in, see Keyboard[3B]), KB_CAPLED# (in, see Keyboard[4C]), KB_CNTR# (in, see ASIC[3C]), KB_INIT1 (in, see DockStation[3A], DockStation[4C]), KB_INIT2 (in, see DockStation[3B], DockStation[4C]), KB_INIT3 (in, see DockStation[3B], DockStation[4C]), KB_INIT4 (in, see DockStation[3B], DockStation[4C]), KB_IRQ1 (in, see ASIC[1C]), KB_IRQ12 (in, see ASIC[1B]), KB_KBCSMI (in, see Keyboard[1D]), KB_KBCSMI (in, see Keyboard[3B]), KB_NUMLED# (in, see Keyboard[3B]), KB_NUMLED# (in, see Keyboard[4C]), KB_PADLED# (in, see Keyboard[3B]), KB_PADLED# (in, see Keyboard[4C]), KB_RESET# (in, see ASIC[2B], ASIC[3C], ASIC[5B], Chipset[5C], Power[5A]), KB_RXD (in, see Keyboard[1D]), KB_RXD (in, see Keyboard[2C]), KB_SCLK# (in, see Chipset[2D]), KB_SCLK_shift (in, see Chipset[1D]), KB_SCRLED# (in, see ASIC[2B]), KB_Sound (in, see Audio[2C]), KB_SPKDN (in, see ASIC[3C], Chipset[5C], Keyboard[1D]), KB_SPKDN (in, see ASIC[3C], Chipset[5C], Keyboard[3B]), KB_SPKUP (in, see ASIC[3C], Power[3B]), KB_SRDY# (in, see Chipset[2D]), KB_TP139 (in, see Keyboard[1D]), KB_TP139 (in, see Keyboard[3B]), KB_TXD (in, see Keyboard[2C]), KB_TXD (in, see Keyboard[4C]), KBCCS# (in, see ASIC[3C]), M38_21 (in, see Power[5C]), M38_P14 (in, see Power[5C]), M38_P14_Buf (in, see ASIC[2B]), M38_P15 (in, see Power[5C]), M38_P15_Buf (in, see ASIC[2B]), M38_P22_R88 (in, see Power[5C]), M38_P27_KB_SPKDN (in, see Power[5C]), M38_P35 (in, see Power[5C]), M38_P36 (in, see Power[5C]), M38_P44 (in, see Power[5C]), Pluto_ESS_AEN (in, see ASIC[4D]), SA[0..15] (in, see ASIC[1B], ASIC[3D], Audio[4B], Chipset[2D], Chipset[6B], PCMCIA[2B], ROM[1B], ROM[3B], Storage[1B], Storage[3B], Super_IO[1B]), SD[0..15] (in, see ASIC[1B], ASIC[3C], Audio[3B], Chipset[2B], PCMCIA[2C], ROM[3B], ROM[5C], Storage[1B], Storage[1C], Storage[3B], Super_IO[1B]), U8_1A3_KB_TP139 (in, see Power[5C]), U8_2A1_KB_RXD (in, see Power[5C]), YMF_RD#_Buf (in, see Audio[3B], Audio[4C]), YMF_WR#_Buf (in, see Audio[3C], Audio[4B])

### Nets
GND: C128.2 C135.2(-) C136.2(-) C264.1(+) C267.1 C268.1(+) C274.2 C275.2 C281.1(+) C283.2(-) J16.2(Pin_2) J19.9(Pin_9) R199.1 R202.1 U67.18(CNVSS) U67.24(VSS) U69.4(GND) U72.12(GND) U72.13(GND) U72.23(G#) U73.1(OEa) U73.10(GND) U73.19(OEb) U75.14(GND) X5.3 X6.3
PNET1: C128.1 C274.1 C275.1 R45.2 R59.2 R372.1 U67.57(VCC) U69.8(VCC) U72.1(VCCA) U72.2(DIR) U73.20(VCC)
PNET3: C136.1(+) D35.2(K) Q8.2(C) R196.2 R197.2 R198.2 R200.2 R201.2 R203.2 R204.2 R205.2 R206.2 U75.1(VADC) U75.28(VDD)
PNET5: Q8.1(E) U72.24(VCCB)
AEN: U69.6 ; port AEN
Bowman_ESS_DACK1#: R372.2 U72.10(A7) ; port Bowman_ESS_DACK1#
D171_GPCLK: C281.2(-) R198.1 U67.20(P41/INT0) U75.22(P0D3/TM0OUT#) U75.23(P0D2/SI) U75.26(Xout) X6.1
D171_GPDATA: R203.1 U67.21(P40/INT4) U75.24(P0D1/SO) U75.25(P0D0/SCK#)
D171_P0A0: J19.6(Pin_6) U75.13(P0A0)
D171_P0A1: J19.5(Pin_5) U75.12(P0A1)
D171_P0A2: J19.4(Pin_4) U75.11(P0A2)
D171_P0A3: J19.3(Pin_3) U75.10(P0A3)
D171_P0B0: J19.15(Pin_15) U75.9(P0B0)
D171_P0B1: J19.14(Pin_14) U75.8(P0B1)
D171_P0B2: J19.13(Pin_13) U75.7(P0B2)
D171_P0B3: J19.12(Pin_12) U75.6(P0B3)
D171_P0C2: J19.2(Pin_2) R205.1 U75.3(P0C2/ADC2)
D171_P0C3: J19.16(Pin_16) R201.1 U75.2(P0C3/ADC3)
D171_P1A0: J19.18(Pin_18) U75.21(P1A0)
D171_P1A1: J19.8(Pin_8) U75.20(P1A1)
D171_P1A2: J19.17(Pin_17) U75.19(P1A2)
D171_P1A3: J19.7(Pin_7) U75.18(P1A3)
ESS_AEN: U72.16(B6) ; port ESS_AEN
ESS_DACK1#: U72.15(B7) ; port ESS_DACK1#
ESS_IRQ1: U73.13(I1b) ; port ESS_IRQ1
ESS_IRQ1_Buf: U73.7(O1b) ; port ESS_IRQ1_Buf
ESS_IRQ2: U73.15(I2b) ; port ESS_IRQ2
ESS_IRQ2_Buf: U73.5(O2b) ; port ESS_IRQ2_Buf
FCS_RESET: U72.11(A8) ; port FCS_RESET
FDC_DS3: U69.1 ; port FDC_DS3
IOR#: U67.5(R#) U72.7(A4) ; port IOR#
IOW#: U67.4(W#) U72.8(A5) ; port IOW#
KB1_0: J17.8(Pin_8) U67.56(P30/DA1)
KB1_1: J17.7(Pin_7) U67.55(P31/DA2)
KB1_2: J17.1(Pin_1) U67.54(P32/ONW#)
KB1_3: J17.6(Pin_6) U67.53(P33)
KB1_4: J17.2(Pin_2) U67.52(P34)
KB1_5: J17.5(Pin_5) U67.51(P35/SYNC)
KB1_6: J17.3(Pin_3) U67.50(P36/WR#)
KB1_7: J17.4(Pin_4) U67.49(P37/RD#)
KB2_1: J16.18(Pin_18) U67.33(P17/AD15)
KB2_2: J16.6(Pin_6) U67.34(P16/AD14)
KB2_3: J16.17(Pin_17) U67.35(P15/AD13)
KB2_4: J16.14(Pin_14) U67.36(P14/AD12)
KB2_5: J16.16(Pin_16) U67.37(P13/AD11)
KB2_6: J16.9(Pin_9) U67.38(P12/AD10)
KB2_7: J16.5(Pin_5) U67.39(P11/AD9)
KB2_8: J16.10(Pin_10) U67.40(P10/AD8)
KB2_9: J16.8(Pin_8) U67.41(P07/AD7)
KB2_10: J16.11(Pin_11) U67.42(P06/AD6)
KB2_11: J16.7(Pin_7) U67.43(P05/AD5)
KB2_12: J16.12(Pin_12) U67.44(P04/AD4)
KB2_13: J16.13(Pin_13) U67.45(P03/AD3)
KB2_14: J16.15(Pin_15) U67.46(P02/AD2)
KB2_15: J16.20(Pin_20) U67.47(P01/AD1)
KB2_16: J16.19(Pin_19) U67.48(P00/AD0)
KB_CAPLED#: U67.27(P25/DB5) U72.4(A1) ; port KB_CAPLED#
KB_CNTR#: U67.59(PC60) ; port KB_CNTR#
KB_INIT1: U67.17(P42/INT1) ; port KB_INIT1
KB_INIT2: U67.16(P43/INT2) ; port KB_INIT2
KB_INIT3: U67.13(P46/SCLK1) ; port KB_INIT3
KB_INIT4: U67.12(P47/SRDY1) ; port KB_INIT4
KB_IRQ1: U67.15(P44/RxD) ; port KB_IRQ1
KB_IRQ12: U67.14(P45/TxD) ; port KB_IRQ12
KB_KBCSMI: U67.32(P20/DB0) U73.12(O3a) ; port KB_KBCSMI
KB_NUMLED#: U67.26(P26/DB6) U72.3(A0) ; port KB_NUMLED#
KB_PADLED#: U67.28(P24/DB4) U72.5(A2) ; port KB_PADLED#
KB_RESET#: C267.2 U67.19(RESET) ; port KB_RESET#
KB_RXD: U67.11(P50/SIN2) U73.9(O0b) ; port KB_RXD
KB_SCLK#: R45.1 U67.9(P52/SCLK2) ; port KB_SCLK#
KB_SCLK_shift: Q8.3(B) ; port KB_SCLK_shift
KB_SCRLED#: U67.25(P27/DB7) ; port KB_SCRLED#
KB_Sound: U67.58(P61) ; port KB_Sound
KB_SPKDN: U67.30(P22/DB2) U73.16(O1a) ; port KB_SPKDN
KB_SPKUP: U67.29(P23/DB3) ; port KB_SPKUP
KB_SRDY#: R59.1 U67.8(P53/SRDY2) ; port KB_SRDY#
KB_TP139: U67.31(P21/DB1) U73.14(O2a) ; port KB_TP139
KB_TXD: U67.10(P51/SOUT2) U72.6(A3) ; port KB_TXD
KBCCS#: U67.6(S#) ; port KBCCS#
M38_21: U72.21(B1) ; port M38_21
M38_P14: U73.17(I3b) ; port M38_P14
M38_P14_Buf: U73.3(O3b) ; port M38_P14_Buf
M38_P15: U73.2(I0a) ; port M38_P15
M38_P15_Buf: U73.18(O0a) ; port M38_P15_Buf
M38_P22_R88: U73.8(I3a) ; port M38_P22_R88
M38_P27_KB_SPKDN: U73.4(I1a) ; port M38_P27_KB_SPKDN
M38_P35: U72.20(B2) ; port M38_P35
M38_P36: U72.22(B0) ; port M38_P36
M38_P44: U72.19(B3) ; port M38_P44
Pluto_ESS_AEN: U69.2 ; port Pluto_ESS_AEN
SA2: U67.7(A0)
SD0: U67.3(DQ0)
SD1: U67.2(DQ1)
SD2: U67.1(DQ2)
SD3: U67.64(DQ3)
SD4: U67.63(DQ4)
SD5: U67.62(DQ5)
SD6: U67.61(DQ6)
SD7: U67.60(DQ7)
TRKPD_Lclick: J16.4(Pin_4) J19.10(Pin_10) R206.1 U75.4(P0C1/ADC1)
TRKPD_Rclick: J16.3(Pin_3) J19.11(Pin_11) R196.1 U75.5(P0C0/ADC0)
U8_1A3_KB_TP139: U73.6(I2a) ; port U8_1A3_KB_TP139
U8_2A1_KB_RXD: U73.11(I0b) ; port U8_2A1_KB_RXD
YMF_RD#_Buf: U72.18(B4) ; port YMF_RD#_Buf
YMF_WR#_Buf: U72.17(B5) ; port YMF_WR#_Buf
NetC135_1: C135.1(+) D35.1(A) D35.3(A) R200.1 U75.16(RESET#)
NetC264_2: C264.2(-) U67.22(Xin) X5.2
NetC268_2: C268.2(-) U67.23(Xout) X5.1
NetC283_1: C283.1(+) U75.27(Xin) X6.2
NetR197_1: R197.1 R202.2 U75.17(P1B0)
NetR199_2: R199.2 R204.1 U75.15(INT)
NetU69_3: U69.3 U72.9(A6)
NetU69_5: U69.5 U69.7

Not connected (* = marked no-connect by the designer): J16 1(Pin_1)*; J19 1(Pin_1)*; U72 14(B8)*

### Notes on the sheet
- Device_Data_BUS
- (near R59) Device_Address_BUS
- 1
- 2
- 3
- 4
- 5
- 6
- 7
- 8
- A
- B
- C
- D
- E
- Title: PC110
- File: Keyboard.kicad_sch
- Sheet: /
- Recreated by: Ahmad Byagowi
- F
- KiCad E.D.A.  kicad (5.1.4)-1
- Size: A3
- Date:
- Rev:
- Id: 1/1

### Library data of the parts
C128 C135 C136 C264 C267 C268 C274 C275 C281 C283 = C
  C128 C136: Value: 150nF; Footprint: Capacitor_SMD:C_0402_1005Metric
  C135: Value: 2.7uF; Footprint: Capacitor_SMD:C_0805_2012Metric
  C264: Value: 56pF; Footprint: Capacitor_SMD:C_0402_1005Metric
  C267: Value: DNP; Footprint: Capacitor_SMD:C_0402_1005Metric
  C268: Value: 56pf; Footprint: Capacitor_SMD:C_0402_1005Metric
  C274 C275: Value: 100nF; Footprint: Capacitor_SMD:C_0402_1005Metric
  C281 C283: Value: 39pF; Footprint: Capacitor_SMD:C_0402_1005Metric
D35 = D_Schottky_Dual_CommonCathode_AKA: Value: 3D; Footprint: PC110:3D
J16 = Conn_01x20: Value: Flat-20; Footprint: PC110:Flat-20
J17 = Conn_01x08: Value: Flat-8; Footprint: PC110:Flat-8
J19 = Conn_01x18: Value: Flat-18; Footprint: PC110:Flat-18
Q8 = Q_PNP_Generic_ECB: Value: 6D; Footprint: PC110:3D
R45 R59 R196-R206 R372 = R
  R45 R59 R201 R205: Value: 100k; Footprint: PCM_Resistor_SMD_AKL:R_0402_1005Metric
  R196 R197 R200 R204 R206: Value: 47k; Footprint: PCM_Resistor_SMD_AKL:R_0402_1005Metric
  R198 R203: Value: 10k; Footprint: PCM_Resistor_SMD_AKL:R_0402_1005Metric
  R199 R202: Value: DNP; Footprint: PCM_Resistor_SMD_AKL:R_0402_1005Metric
  R372: Value: 100k; Footprint: Resistor_SMD:R_0402_1005Metric
U67 = M38813: Value: M38813M4; Footprint: PC110:QFN64
U69 = 74LVC2G32: Value: SN74LVC2G32; Footprint: Package_SO:SSOP-8_2.95x2.8mm_P0.65mm
U73 = 74LS244: Value: SN74LVT244B; Footprint: Package_SO:TSSOP-20_4.4x6.5mm_P0.65mm
U75 = D17137: Value: D17137AGT; Footprint: PC110:SSOP-28
X5 X6 = Crystal_GND3
  X5: Value: 4.00; Footprint: PC110:XTAL-5
  X6: Value: 8.00; Footprint: PC110:XTAL-4
U72 = HD151015: Value: HD151015; Footprint: Package_SO:SSOP-24_5.3x8.2mm_P0.65mm

## Sheet VGA.SchDoc
size 594 x 420 mm
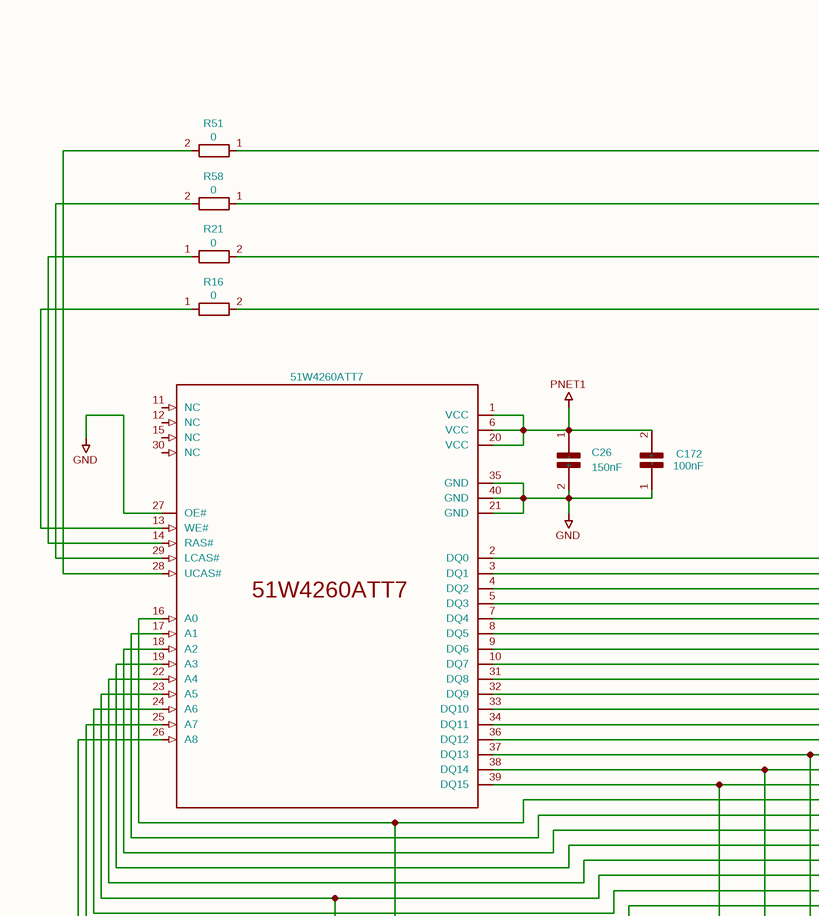
[diagram p28: VGA.SchDoc, top left]
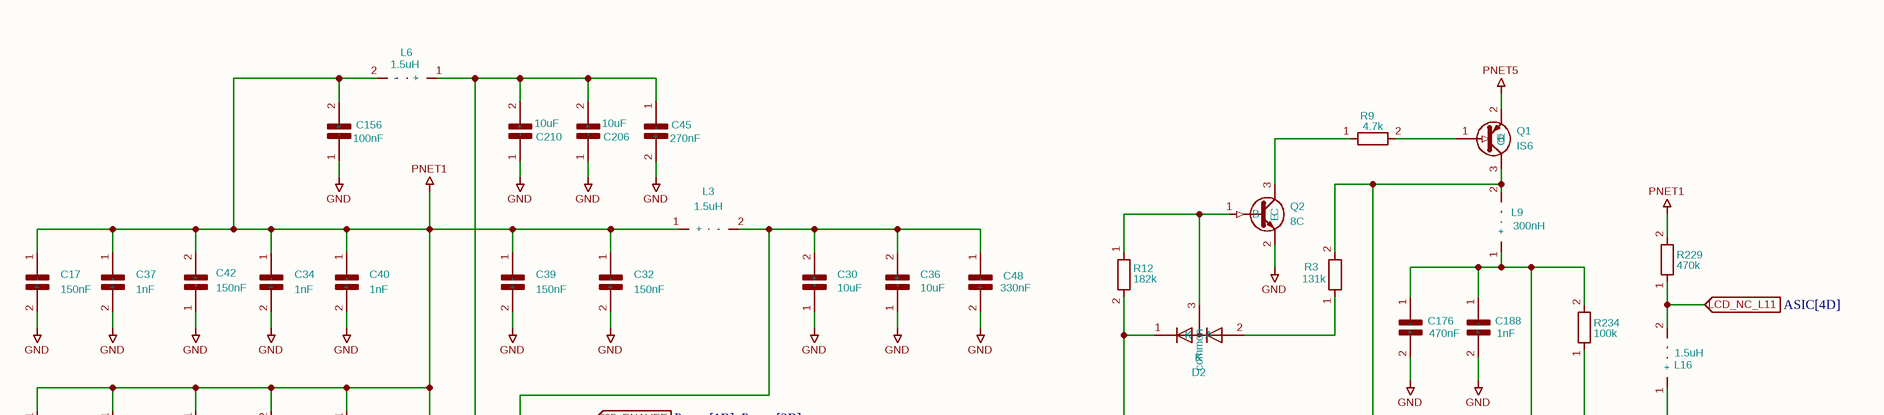
[diagram p29: VGA.SchDoc, top right]
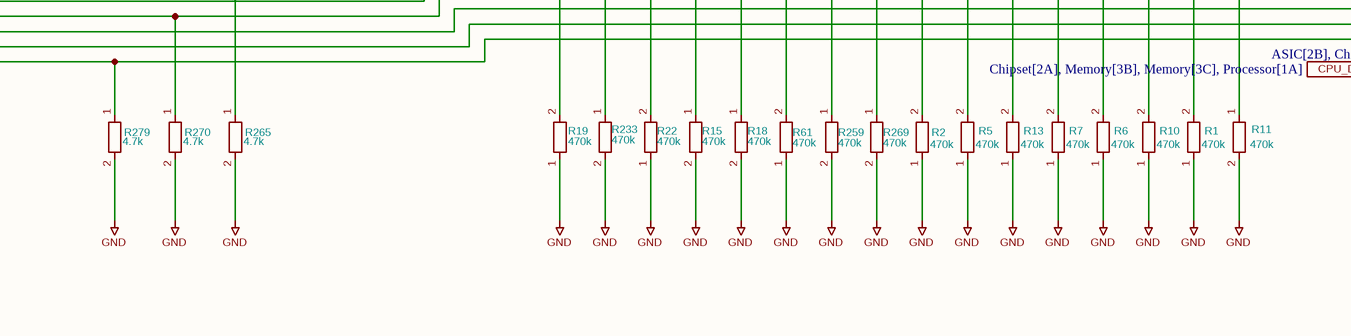
[diagram p30: VGA.SchDoc, bottom left]
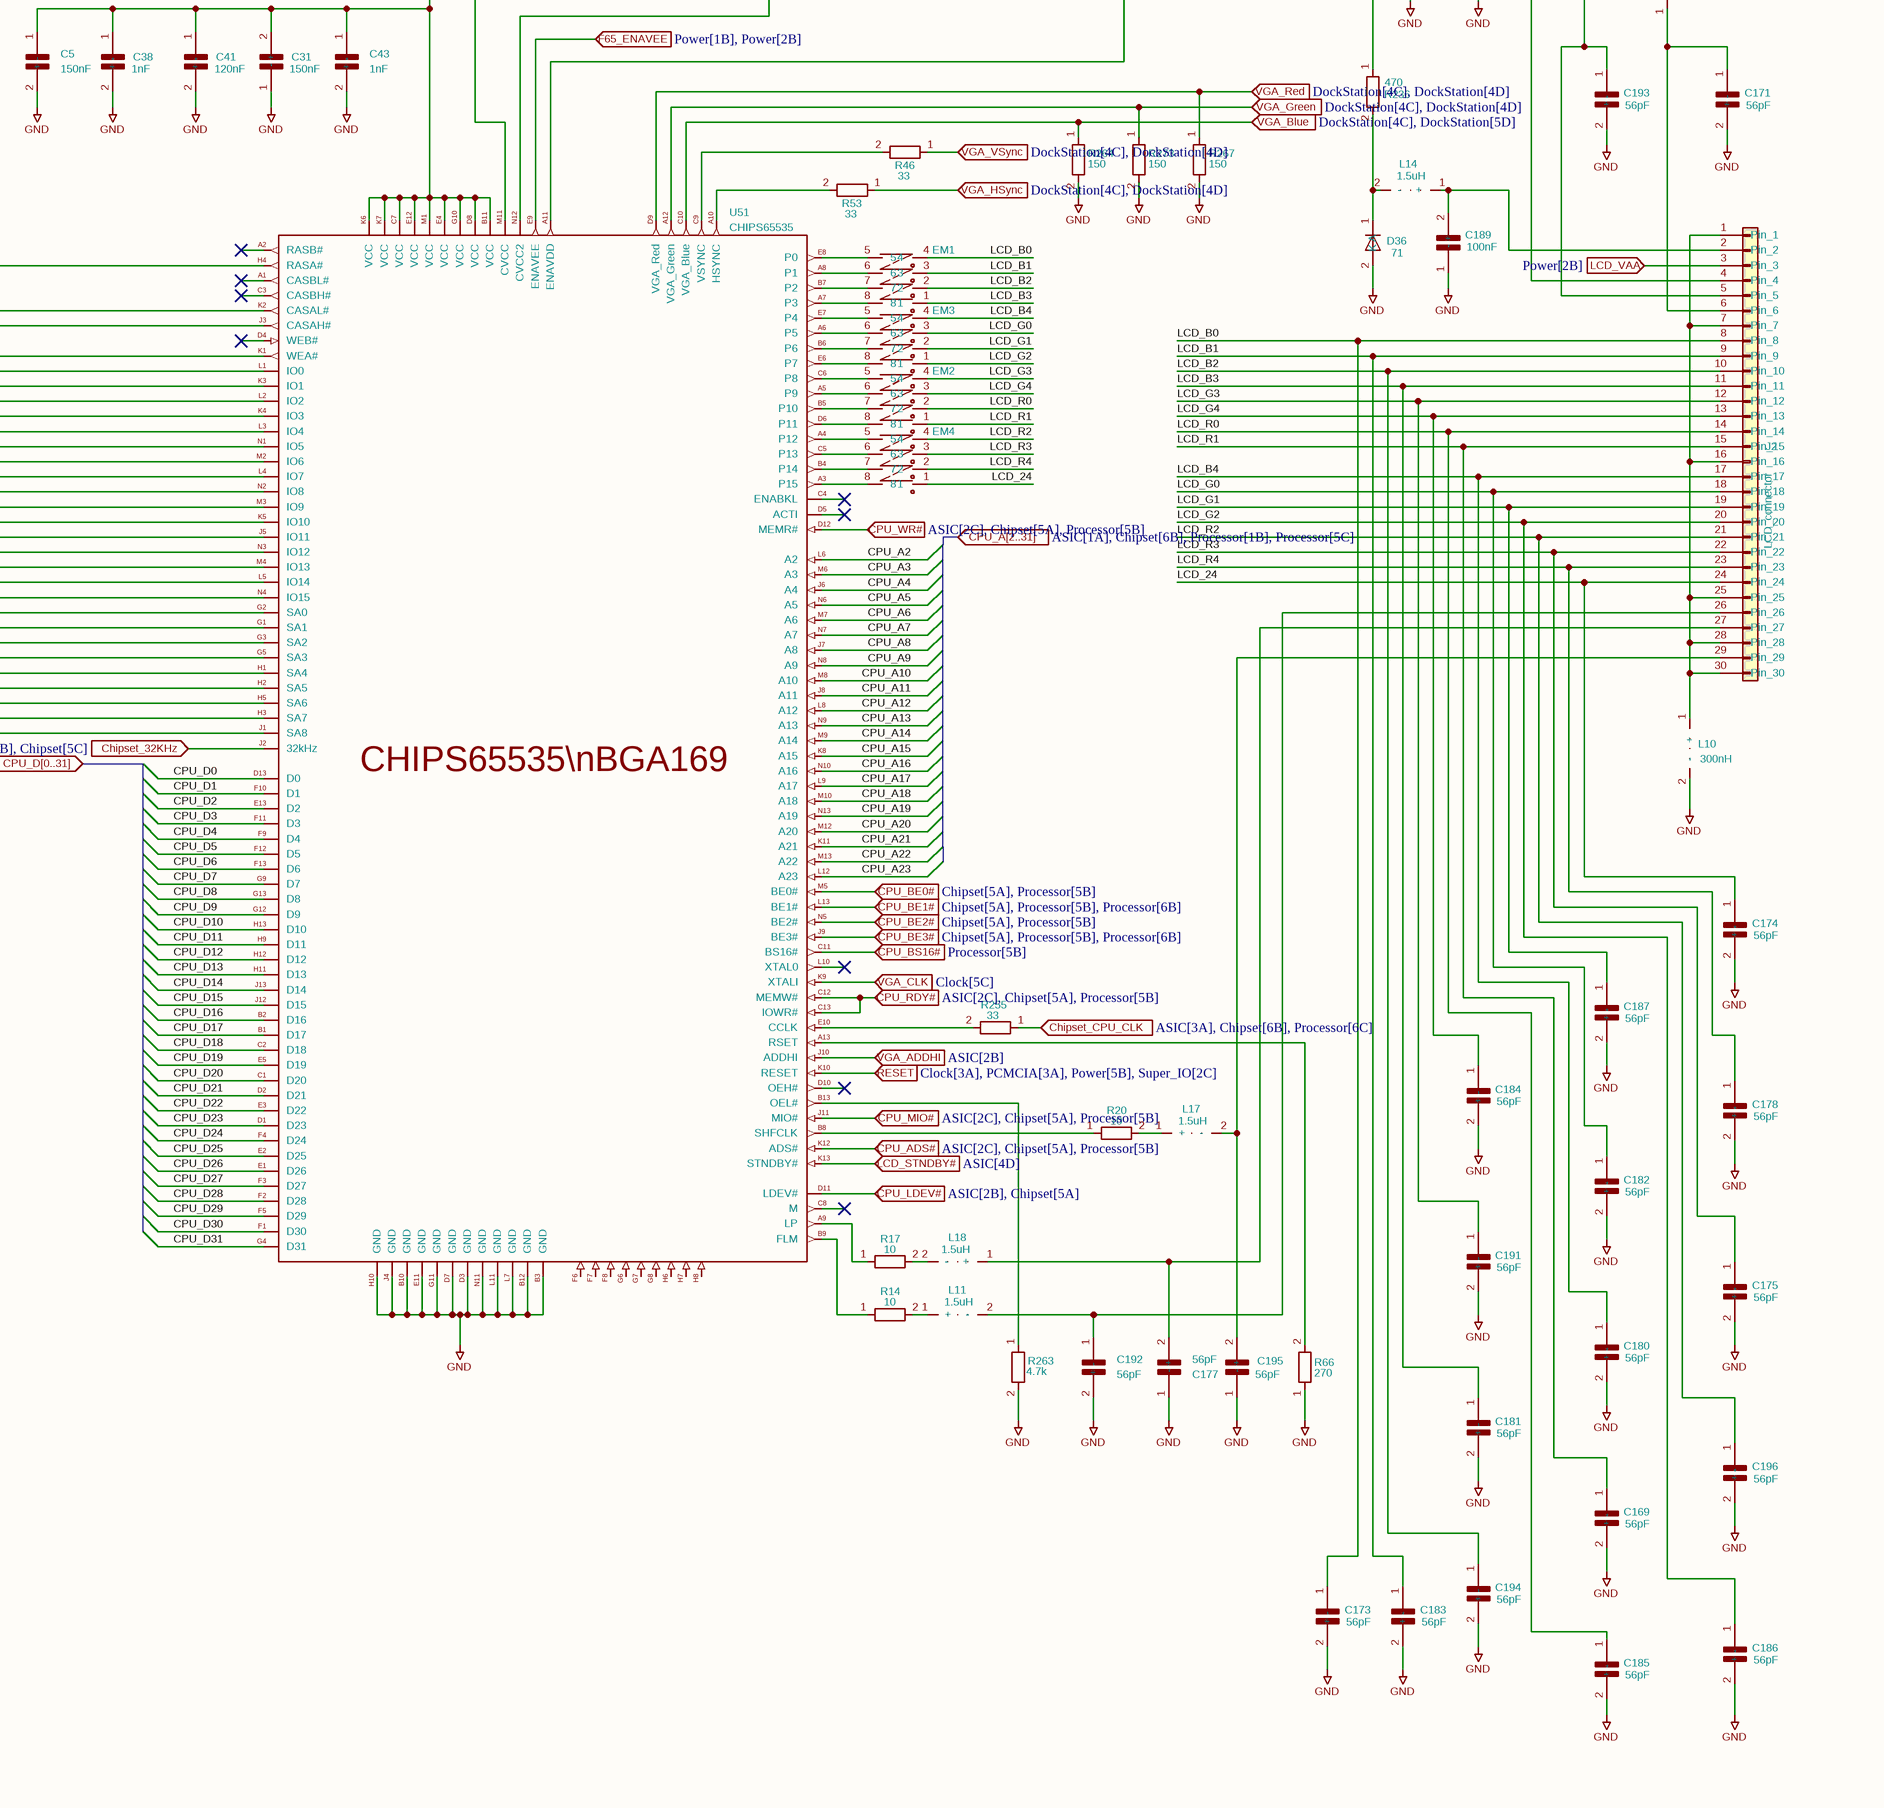
[diagram p31: VGA.SchDoc, bottom right]

### Parts
C5  150nF  [C_0402_1005Metric]
C17  150nF  [C_0402_1005Metric]
C26  150nF  [C_0402_1005Metric]
C30  10uF  [C_1206_3216Metric]
C31  150nF  [C_0402_1005Metric]
C32  150nF  [C_0402_1005Metric]
C34  1nF  [C_0402_1005Metric]
C36  10uF  [C_1206_3216Metric]
C37  1nF  [C_0402_1005Metric]
C38  1nF  [C_0402_1005Metric]
C39  150nF  [C_0402_1005Metric]
C40  1nF  [C_0402_1005Metric]
C41  120nF  [C_0402_1005Metric]
C42  150nF  [C_0402_1005Metric]
C43  1nF  [C_0402_1005Metric]
C45  270nF  [C_0603_1608Metric]
C48  330nF  [C_0402_1005Metric]
C156  100nF  [C_0402_1005Metric]
C169  56pF  [C_0402_1005Metric]
C171  56pF  [C_0402_1005Metric]
C172  100nF  [C_0402_1005Metric]
C173  56pF  [C_0402_1005Metric]
C174  56pF  [C_0402_1005Metric]
C175  56pF  [C_0402_1005Metric]
C176  470nF  [C_0603_1608Metric]
C177  56pF  [C_0402_1005Metric]
C178  56pF  [C_0402_1005Metric]
C180  56pF  [C_0402_1005Metric]
C181  56pF  [C_0402_1005Metric]
C182  56pF  [C_0402_1005Metric]
C183  56pF  [C_0402_1005Metric]
C184  56pF  [C_0402_1005Metric]
C185  56pF  [C_0402_1005Metric]
C186  56pF  [C_0402_1005Metric]
C187  56pF  [C_0402_1005Metric]
C188  1nF  [C_0402_1005Metric]
C189  100nF  [C_0402_1005Metric]
C191  56pF  [C_0402_1005Metric]
C192  56pF  [C_0402_1005Metric]
C193  56pF  [C_0402_1005Metric]
C194  56pF  [C_0402_1005Metric]
C195  56pF  [C_0402_1005Metric]
C196  56pF  [C_0402_1005Metric]
C206  10uF  [C_1206_3216Metric]
C210  10uF  [C_1206_3216Metric]
D2  K  [SOT-416L]
D36  71  [D_0603_1608Metric]
EM1  R-array  [R-array]  (value not drawn)
EM2  R-array  [R-array]  (value not drawn)
EM3  R-array  [R-array]  (value not drawn)
EM4  R-array  [R-array]  (value not drawn)
J2  LCD_connector  [LCD_connector]
L3  1.5uH  [L_0603_1608Metric]
L6  1.5uH  [L_0603_1608Metric]
L9  300nH  [L_0805_2012Metric]
L10  300nH  [L_0805_2012Metric]
L11  1.5uH  [L_0603_1608Metric]
L14  1.5uH  [L_0603_1608Metric]
L16  1.5uH  [L_0603_1608Metric]
L17  1.5uH  [L_0603_1608Metric]
L18  1.5uH  [L_0603_1608Metric]
Q1  IS6  [SOT-23]
Q2  8C  [SOT-416]
R1  470k  [R_0402_1005Metric]
R2  470k  [R_0402_1005Metric]
R3  131k  [R_0402_1005Metric]
R5  470k  [R_0402_1005Metric]
R6  470k  [R_0402_1005Metric]
R7  470k  [R_0402_1005Metric]
R9  4.7k  [R_0402_1005Metric]
R10  470k  [R_0402_1005Metric]
R11  470k  [R_0402_1005Metric]
R12  182k  [R_0402_1005Metric]
R13  470k  [R_0402_1005Metric]
R14  10  [R_0402_1005Metric]
R15  470k  [R_0402_1005Metric]
R16  0  [R_0402_1005Metric]
R17  10  [R_0402_1005Metric]
R18  470k  [R_0402_1005Metric]
R19  470k  [R_0402_1005Metric]
R20  10  [R_0402_1005Metric]
R21  0  [R_0402_1005Metric]
R22  470k  [R_0402_1005Metric]
R46  33  [R_0402_1005Metric]
R51  0  [R_0402_1005Metric]
R53  33  [R_0402_1005Metric]
R58  0  [R_0402_1005Metric]
R61  470k  [R_0402_1005Metric]
R66  270  [R_0402_1005Metric]
R229  470k  [R_0402_1005Metric]
R233  470k  [R_0402_1005Metric]
R234  100k  [R_0402_1005Metric]
R236  470  [R_0402_1005Metric]
R255  33  [R_0402_1005Metric]
R259  470k  [R_0402_1005Metric]
R263  4.7k  [R_0402_1005Metric]
R264  150  [R_0805_2012Metric]
R265  4.7k  [R_0402_1005Metric]
R267  150  [R_0805_2012Metric]
R269  470k  [R_0402_1005Metric]
R270  4.7k  [R_0402_1005Metric]
R273  150  [R_0805_2012Metric]
R279  4.7k  [R_0402_1005Metric]
U8  51W4260ATT7  [GRAMchip]
U51  CHIPS65535  [BGA-169]

### Ports
Chipset_32KHz (in, see ASIC[2B], Chipset[5C]), Chipset_CPU_CLK (in, see ASIC[3A], Chipset[6B], Processor[6C]), CPU_A[2..31] (in, see ASIC[1A], Chipset[6B], Processor[1B], Processor[5C]), CPU_ADS# (in, see ASIC[2C], Chipset[5A], Processor[5B]), CPU_BE0# (in, see Chipset[5A], Processor[5B]), CPU_BE1# (in, see Chipset[5A], Processor[5B], Processor[6B]), CPU_BE2# (in, see Chipset[5A], Processor[5B]), CPU_BE3# (in, see Chipset[5A], Processor[5B], Processor[6B]), CPU_BS16# (in, see Processor[5B]), CPU_D[0..31] (in, see Chipset[2A], Memory[3B], Memory[3C], Processor[1A]), CPU_LDEV# (in, see ASIC[2B], Chipset[5A]), CPU_MIO# (in, see ASIC[2C], Chipset[5A], Processor[5B]), CPU_RDY# (in, see ASIC[2C], Chipset[5A], Processor[5B]), CPU_WR# (in, see ASIC[2C], Chipset[5A], Processor[5B]), F65_ENAVEE (in, see Power[1B], Power[2B]), LCD_NC_L11 (in, see ASIC[4D]), LCD_STNDBY# (in, see ASIC[4D]), LCD_VAA (in, see Power[2B]), RESET (in, see Clock[3A], PCMCIA[3A], Power[5B], Super_IO[2C]), VGA_ADDHI (in, see ASIC[2B]), VGA_Blue (in, see DockStation[4C], DockStation[5D]), VGA_CLK (in, see Clock[5C]), VGA_Green (in, see DockStation[4C], DockStation[4D]), VGA_HSync (in, see DockStation[4C], DockStation[4D]), VGA_Red (in, see DockStation[4C], DockStation[4D]), VGA_VSync (in, see DockStation[4C], DockStation[4D])

### Nets
GND: C5.2(-) C17.2(-) C26.2(-) C30.1(+) C31.1(+) C32.2(-) C34.2(-) C36.1(+) C37.2(-) C38.2(-) C39.2(-) C40.2(-) C41.2(-) C42.1(+) C43.2(-) C45.2(-) C48.2(-) C156.1(+) C169.2(-) C171.2(-) C172.1(+) C173.2(-) C174.2(-) C175.2(-) C176.2(-) C177.1(+) C178.2(-) C180.2(-) C181.2(-) C182.2(-) C183.2(-) C184.2(-) C185.2(-) C186.2(-) C187.2(-) C188.2(-) C189.1(+) C191.2(-) C192.2(-) C193.2(-) C194.2(-) C195.1(+) C196.2(-) C206.1(+) C210.1(+) D36.2(A) L10.2(-) Q2.2(E) R1.1 R2.1 R5.1 R6.1 R7.1 R10.1 R11.2 R13.1 R15.2 R18.2 R19.1 R22.1 R61.1 R66.1 R233.2 R259.2 R263.2 R264.2 R265.2 R267.2 R269.2 R270.2 R273.2 R279.2 U8.21(GND) U8.27(OE#) U8.35(GND) U8.40(GND) U51.B3(GND) U51.B10(GND) U51.B12(GND) U51.D3(GND) U51.D7(GND) U51.E11(GND) U51.G11(GND) U51.H10(GND) U51.J4(GND) U51.L7(GND) U51.L11(GND) U51.N11(GND)
PNET1: C5.1(+) C17.1(+) C26.1(+) C31.2(-) C32.1(+) C34.1(+) C37.1(+) C38.1(+) C39.1(+) C40.1(+) C41.1(+) C42.2(-) C43.1(+) C156.2(-) C172.2(-) L3.1(+) L6.2(-) R229.2 U8.1(VCC) U8.6(VCC) U8.20(VCC) U51.B11(VCC) U51.C7(VCC) U51.D8(VCC) U51.E4(VCC) U51.E12(VCC) U51.G10(VCC) U51.K6(VCC) U51.K7(VCC) U51.M1(VCC)
PNET5: Q1.2(E)
Chipset_32KHz: U51.J2(32kHz) ; port Chipset_32KHz
Chipset_CPU_CLK: R255.1 ; port Chipset_CPU_CLK
CPU_A2: U51.L6(A2)
CPU_A3: U51.M6(A3)
CPU_A4: U51.J6(A4)
CPU_A5: U51.N6(A5)
CPU_A6: U51.M7(A6)
CPU_A7: U51.N7(A7)
CPU_A8: U51.J7(A8)
CPU_A9: U51.N8(A9)
CPU_A10: U51.M8(A10)
CPU_A11: U51.J8(A11)
CPU_A12: U51.L8(A12)
CPU_A13: U51.N9(A13)
CPU_A14: U51.M9(A14)
CPU_A15: U51.K8(A15)
CPU_A16: U51.N10(A16)
CPU_A17: U51.L9(A17)
CPU_A18: U51.M10(A18)
CPU_A19: U51.N13(A19)
CPU_A20: U51.M12(A20)
CPU_A21: U51.K11(A21)
CPU_A22: U51.M13(A22)
CPU_A23: U51.L12(A23)
CPU_ADS#: U51.K12(ADS#) ; port CPU_ADS#
CPU_BE0#: U51.M5(BE0#) ; port CPU_BE0#
CPU_BE1#: U51.L13(BE1#) ; port CPU_BE1#
CPU_BE2#: U51.N5(BE2#) ; port CPU_BE2#
CPU_BE3#: U51.J9(BE3#) ; port CPU_BE3#
CPU_BS16#: U51.C11(BS16#) ; port CPU_BS16#
CPU_D0: U51.D13(D0)
CPU_D1: U51.F10(D1)
CPU_D2: U51.E13(D2)
CPU_D3: U51.F11(D3)
CPU_D4: U51.F9(D4)
CPU_D5: U51.F12(D5)
CPU_D6: U51.F13(D6)
CPU_D7: U51.G9(D7)
CPU_D8: U51.G13(D8)
CPU_D9: U51.G12(D9)
CPU_D10: U51.H13(D10)
CPU_D11: U51.H9(D11)
CPU_D12: U51.H12(D12)
CPU_D13: U51.H11(D13)
CPU_D14: U51.J13(D14)
CPU_D15: U51.J12(D15)
CPU_D16: U51.B2(D16)
CPU_D17: U51.B1(D17)
CPU_D18: U51.C2(D18)
CPU_D19: U51.E5(D19)
CPU_D20: U51.C1(D20)
CPU_D21: U51.D2(D21)
CPU_D22: U51.E3(D22)
CPU_D23: U51.D1(D23)
CPU_D24: U51.F4(D24)
CPU_D25: U51.E2(D25)
CPU_D26: U51.E1(D26)
CPU_D27: U51.F3(D27)
CPU_D28: U51.F2(D28)
CPU_D29: U51.F5(D29)
CPU_D30: U51.F1(D30)
CPU_D31: U51.G4(D31)
CPU_LDEV#: U51.D11(LDEV#) ; port CPU_LDEV#
CPU_MIO#: U51.J11(MIO#) ; port CPU_MIO#
CPU_RDY#: U51.C12(MEMW#) U51.C13(IOWR#) ; port CPU_RDY#
CPU_WR#: U51.D12(MEMR#) ; port CPU_WR#
F65_ENAVEE: U51.E9(ENAVEE) ; port F65_ENAVEE
LCD_24: C174.1(+) EM4.1 J2.24(Pin_24)
LCD_B0: C173.1(+) EM1.4 J2.8(Pin_8)
LCD_B1: C183.1(+) EM1.3 J2.9(Pin_9)
LCD_B2: C194.1(+) EM1.2 J2.10(Pin_10)
LCD_B3: C181.1(+) EM1.1 J2.11(Pin_11)
LCD_B4: C180.1(+) EM3.4 J2.17(Pin_17)
LCD_G0: C182.1(+) EM3.3 J2.18(Pin_18)
LCD_G1: C187.1(+) EM3.2 J2.19(Pin_19)
LCD_G2: C186.1(+) EM3.1 J2.20(Pin_20)
LCD_G3: C191.1(+) EM2.4 J2.12(Pin_12)
LCD_G4: C184.1(+) EM2.3 J2.13(Pin_13)
LCD_NC_L11: L16.2(-) R229.1 ; port LCD_NC_L11
LCD_R0: C185.1(+) EM2.2 J2.14(Pin_14)
LCD_R1: C169.1(+) EM2.1 J2.15(Pin_15)
LCD_R2: C196.1(+) EM4.4 J2.21(Pin_21)
LCD_R3: C175.1(+) EM4.3 J2.22(Pin_22)
LCD_R4: C178.1(+) EM4.2 J2.23(Pin_23)
LCD_STNDBY#: U51.K13(STNDBY#) ; port LCD_STNDBY#
LCD_VAA: J2.3(Pin_3) ; port LCD_VAA
RESET: U51.K10(RESET) ; port RESET
VGA_ADDHI: U51.J10(ADDHI) ; port VGA_ADDHI
VGA_Blue: R264.1 U51.C10(VGA_Blue) ; port VGA_Blue
VGA_CLK: U51.K9(XTALI) ; port VGA_CLK
VGA_Green: R273.1 U51.A12(VGA_Green) ; port VGA_Green
VGA_HSync: R53.1 ; port VGA_HSync
VGA_Red: R267.1 U51.D9(VGA_Red) ; port VGA_Red
VGA_VSync: R46.1 ; port VGA_VSync
NetC30_2: C30.2(-) C36.2(-) C48.1(+) L3.2(-) U51.N12(CVCC2)
NetC45_1: C45.1(+) C206.2(-) C210.2(-) L6.1(+) U51.M11(CVCC)
NetC171_1: C171.1(+) J2.6(Pin_6) L16.1(+)
NetC176_1: C176.1(+) C188.1(+) J2.4(Pin_4) L9.1(+) R234.2
NetC177_2: C177.2(-) J2.27(Pin_27) L18.1(+)
NetC189_2: C189.2(-) J2.2(Pin_2) L14.1(+)
NetC192_1: C192.1(+) J2.26(Pin_26) L11.2(-)
NetC193_1: C193.1(+) J2.5(Pin_5) R234.1
NetC195_2: C195.2(-) J2.29(Pin_29) L17.2(-)
NetD2_1: D2.1(K) R12.2 U51.A11(ENAVDD)
NetD2_2: D2.2(A) R3.1
NetD2_3: D2.3(common) Q2.1(B) R12.1
NetD36_1: D36.1(K) L14.2(-) R236.2
NetEM1_5: EM1.5 U51.E8(P0)
NetEM1_6: EM1.6 U51.A8(P1)
NetEM1_7: EM1.7 U51.B7(P2)
NetEM1_8: EM1.8 U51.A7(P3)
NetEM2_5: EM2.5 U51.C6(P8)
NetEM2_6: EM2.6 U51.A5(P9)
NetEM2_7: EM2.7 U51.B5(P10)
NetEM2_8: EM2.8 U51.D6(P11)
NetEM3_5: EM3.5 U51.E7(P4)
NetEM3_6: EM3.6 U51.A6(P5)
NetEM3_7: EM3.7 U51.B6(P6)
NetEM3_8: EM3.8 U51.E6(P7)
NetEM4_5: EM4.5 U51.A4(P12)
NetEM4_6: EM4.6 U51.C5(P13)
NetEM4_7: EM4.7 U51.B4(P14)
NetEM4_8: EM4.8 U51.A3(P15)
NetJ2_1: J2.1(Pin_1) J2.7(Pin_7) J2.16(Pin_16) J2.25(Pin_25) J2.28(Pin_28) J2.30(Pin_30) L10.1(+)
NetL9_2: L9.2(-) Q1.3(C) R3.2 R236.1
NetL11_1: L11.1(+) R14.2
NetL17_1: L17.1(+) R20.2
NetL18_2: L18.2(-) R17.2
NetQ1_1: Q1.1(B) R9.2
NetQ2_3: Q2.3(C) R9.1
NetR1_2: R1.2 U8.3(DQ1) U51.K3(IO1)
NetR2_2: R2.2 U8.10(DQ7) U51.L4(IO7)
NetR5_2: R5.2 U8.9(DQ6) U51.M2(IO6)
NetR6_2: R6.2 U8.5(DQ3) U51.K4(IO3)
NetR7_2: R7.2 U8.7(DQ4) U51.L3(IO4)
NetR10_2: R10.2 U8.4(DQ2) U51.L2(IO2)
NetR11_1: R11.1 U8.2(DQ0) U51.L1(IO0)
NetR13_2: R13.2 U8.8(DQ5) U51.N1(IO5)
NetR14_1: R14.1 U51.B9(FLM)
NetR15_1: R15.1 U8.36(DQ12) U51.N3(IO12)
NetR16_1: R16.1 U8.13(WE#)
NetR16_2: R16.2 U51.K1(WEA#)
NetR17_1: R17.1 U51.A9(LP)
NetR18_1: R18.1 U8.34(DQ11) U51.J5(IO11)
NetR19_2: R19.2 U8.39(DQ15) U51.N4(IO15)
NetR20_1: R20.1 U51.B8(SHFCLK)
NetR21_1: R21.1 U8.14(RAS#)
NetR21_2: R21.2 U51.H4(RASA#)
NetR22_2: R22.2 U8.37(DQ13) U51.M4(IO13)
NetR46_2: R46.2 U51.C9(VSYNC)
NetR51_1: R51.1 U51.J3(CASAH#)
NetR51_2: R51.2 U8.28(UCAS#)
NetR53_2: R53.2 U51.A10(HSYNC)
NetR58_1: R58.1 U51.K2(CASAL#)
NetR58_2: R58.2 U8.29(LCAS#)
NetR61_2: R61.2 U8.33(DQ10) U51.K5(IO10)
NetR66_2: R66.2 U51.A13(RSET)
NetR233_1: R233.1 U8.38(DQ14) U51.L5(IO14)
NetR255_2: R255.2 U51.E10(CCLK)
NetR259_1: R259.1 U8.32(DQ9) U51.M3(IO9)
NetR263_1: R263.1 U51.B13(OEL#)
NetR265_1: R265.1 U8.16(A0) U51.G2(SA0)
NetR269_1: R269.1 U8.31(DQ8) U51.N2(IO8)
NetR270_1: R270.1 U8.23(A5) U51.H2(SA5)
NetR279_1: R279.1 U8.26(A8) U51.J1(SA8)
NetU8_17: U8.17(A1) U51.G1(SA1)
NetU8_18: U8.18(A2) U51.G3(SA2)
NetU8_19: U8.19(A3) U51.G5(SA3)
NetU8_22: U8.22(A4) U51.H1(SA4)
NetU8_24: U8.24(A6) U51.H5(SA6)
NetU8_25: U8.25(A7) U51.H3(SA7)

Not connected (* = marked no-connect by the designer): U8 11(NC) 12(NC) 15(NC) 30(NC); U51 A1(CASBL#)* A2(RASB#)* C3(CASBH#)* C4(ENABKL)* C8(M)* D4(WEB#)* D5(ACTI)* D10(OEH#)* F6 F7 F8 G6 G7 G8 H6 H7 H8 L10(XTAL0)*

### Notes on the sheet
- 1
- 2
- 3
- 4
- 5
- 6
- 7
- 8
- 9
- 10
- 11
- A
- B
- C
- D
- E
- F
- G
- H
- Title: PC110
- File: VGA.kicad_sch
- Sheet: /
- Recreated by: Ahmad Byagowi
- KiCad E.D.A.  kicad (5.1.4)-1
- Size: A2
- Date:
- Rev:
- Id: 1/1
- (in symbol 65535) CHIPS65535\nBGA169

### Library data of the parts
C5 C17 C26 C30-C32 C34 C36-C43 C45 C48 C156 C169 C171-C178 C180-C189 C191-C196 C206 C210 = C
  C5 C17 C26 C31 C32 C39 C42: Value: 150nF; Footprint: Capacitor_SMD:C_0402_1005Metric
  C30 C36 C206 C210: Value: 10uF; Footprint: Capacitor_SMD:C_1206_3216Metric
  C34 C37 C38 C40 C43 C188: Value: 1nF; Footprint: Capacitor_SMD:C_0402_1005Metric
  C41: Value: 120nF; Footprint: Capacitor_SMD:C_0402_1005Metric
  C45: Value: 270nF; Footprint: Capacitor_SMD:C_0603_1608Metric
  C48: Value: 330nF; Footprint: Capacitor_SMD:C_0402_1005Metric
  C156 C172 C189: Value: 100nF; Footprint: Capacitor_SMD:C_0402_1005Metric
  C169 C171 C173-C175 C177 C178 C180-C187 C191-C196: Value: 56pF; Footprint: Capacitor_SMD:C_0402_1005Metric
  C176: Value: 470nF; Footprint: Capacitor_SMD:C_0603_1608Metric
D2 = D_Dual_Series_KAC: Value: K; Footprint: PC110:SOT-416L
D36 = D: Value: 71; Footprint: Diode_SMD:D_0603_1608Metric
EM1 = EMI_filter_Array: Value: R-array; Footprint: PC110:R-array
EM2 = EMI_filter_Array_2: Value: R-array; Footprint: PC110:R-array
EM3 = EMI_filter_Array_1: Value: R-array; Footprint: PC110:R-array
EM4 = EMI_filter_Array_3: Value: R-array; Footprint: PC110:R-array
J2 = Conn_01x30: Value: LCD_connector; Footprint: PC110:LCD_connector
L3 L6 L9-L11 L14 L16-L18 = L
  L3 L6 L11 L14 L16-L18: Value: 1.5uH; Footprint: Inductor_SMD:L_0603_1608Metric
  L9 L10: Value: 300nH; Footprint: Inductor_SMD:L_0805_2012Metric
Q1 = Q_PNP_Generic_BEC: Value: IS6; Footprint: PCM_Package_TO_SOT_SMD_AKL:SOT-23
Q2 = MMBTA44: Value: 8C; Footprint: Package_TO_SOT_SMD:SOT-416
R1-R3 R5-R7 R9-R22 R46 R51 R53 R58 R61 R66 R229 R233 R234 R236 R255 R259 R263-R265 R267 R269 R270 R273 R279 = R
  R1 R2 R5-R7 R10 R11 R13 R15 R18 R19 R22 R61 R229 R233 R259 R269: Value: 470k; Footprint: PCM_Resistor_SMD_AKL:R_0402_1005Metric
  R3: Value: 131k; Footprint: PCM_Resistor_SMD_AKL:R_0402_1005Metric
  R9 R263 R265 R270 R279: Value: 4.7k; Footprint: PCM_Resistor_SMD_AKL:R_0402_1005Metric
  R12: Value: 182k; Footprint: PCM_Resistor_SMD_AKL:R_0402_1005Metric
  R14 R17 R20: Value: 10; Footprint: PCM_Resistor_SMD_AKL:R_0402_1005Metric
  R16 R21 R51 R58: Value: 0; Footprint: PCM_Resistor_SMD_AKL:R_0402_1005Metric
  R46 R53 R255: Value: 33; Footprint: PCM_Resistor_SMD_AKL:R_0402_1005Metric
  R66: Value: 270; Footprint: PCM_Resistor_SMD_AKL:R_0402_1005Metric
  R234: Value: 100k; Footprint: PCM_Resistor_SMD_AKL:R_0402_1005Metric
  R236: Value: 470; Footprint: PCM_Resistor_SMD_AKL:R_0402_1005Metric
  R264 R267 R273: Value: 150; Footprint: PCM_Resistor_SMD_AKL:R_0805_2012Metric
U8 = 51W4260: Value: 51W4260ATT7; Footprint: PC110:GRAMchip
U51 = 65535: Value: CHIPS65535; Footprint: PC110:BGA-169